# EAGLE design 612_jetracer_328_020032 (EAGLE 9.6.2)
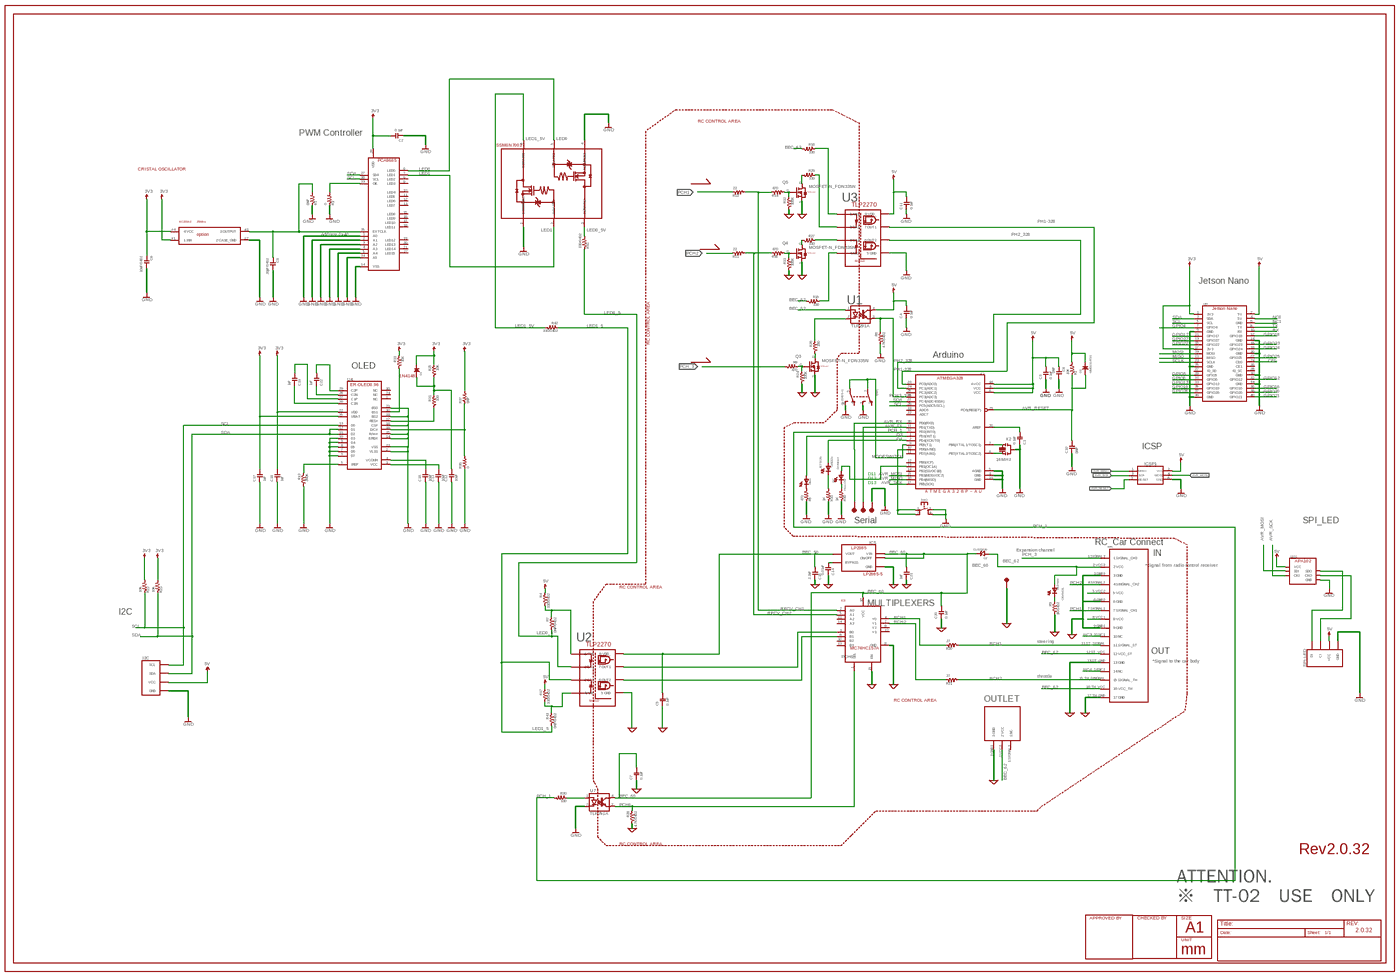
[diagram p0: schematic, sheet 1, overview]
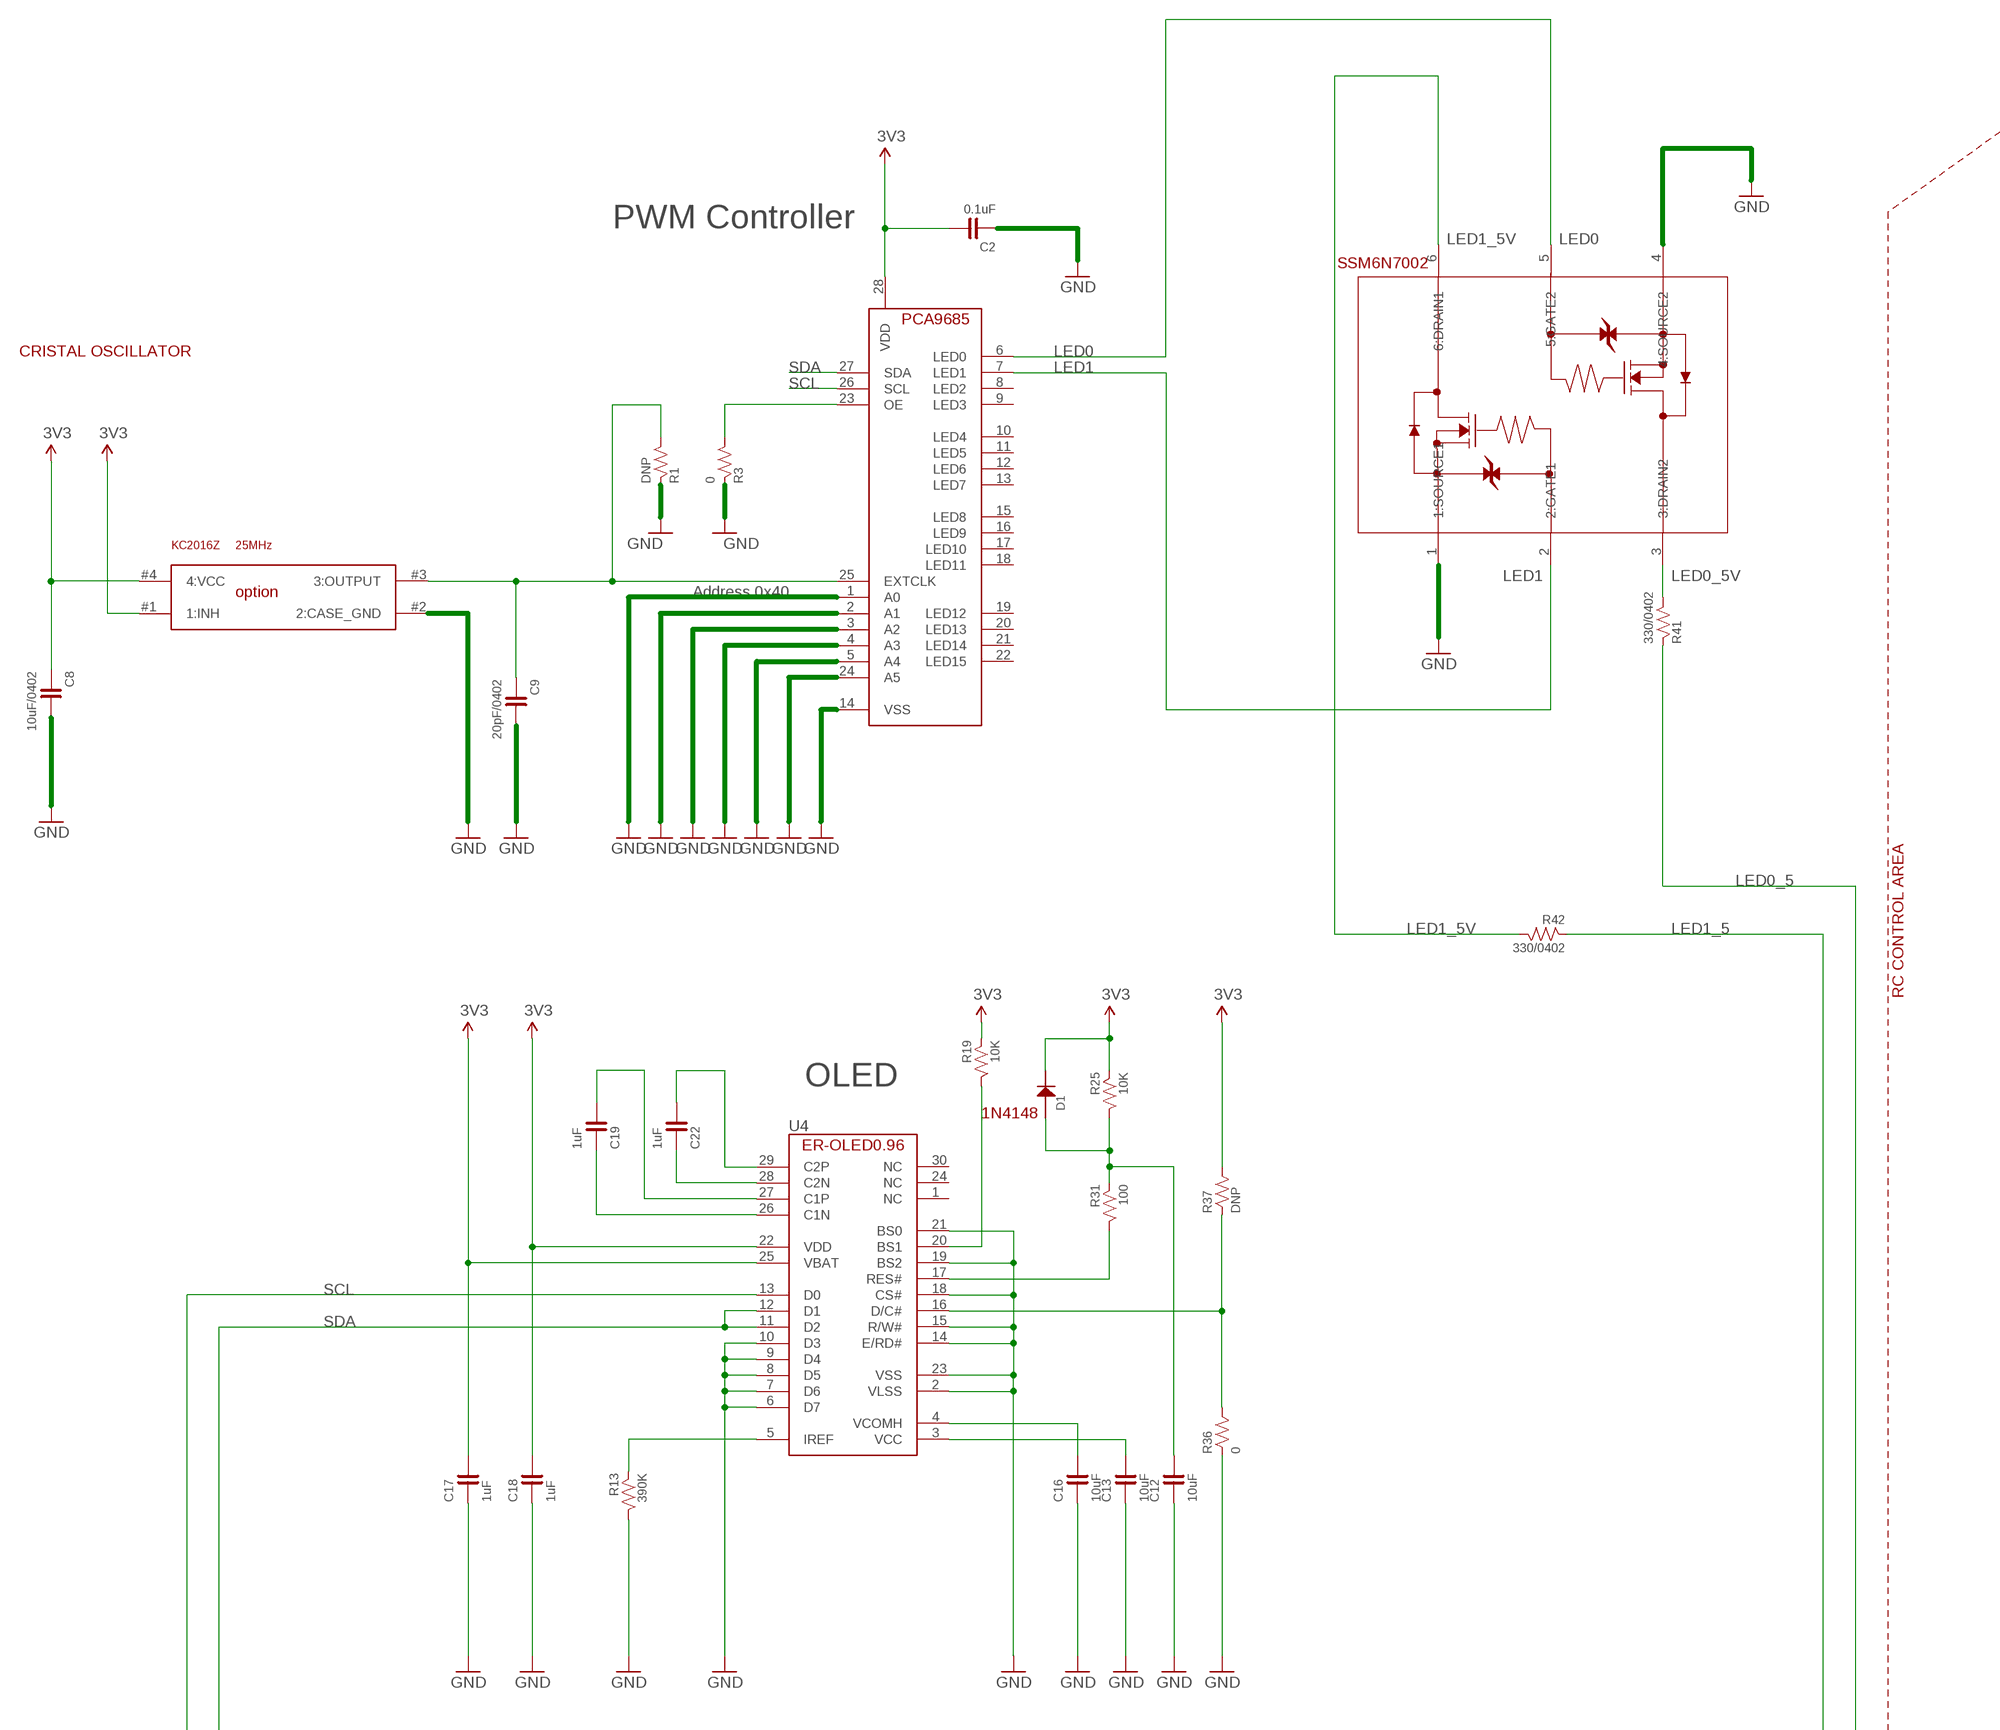
[diagram p1: schematic, sheet 1, part 1 of 4]
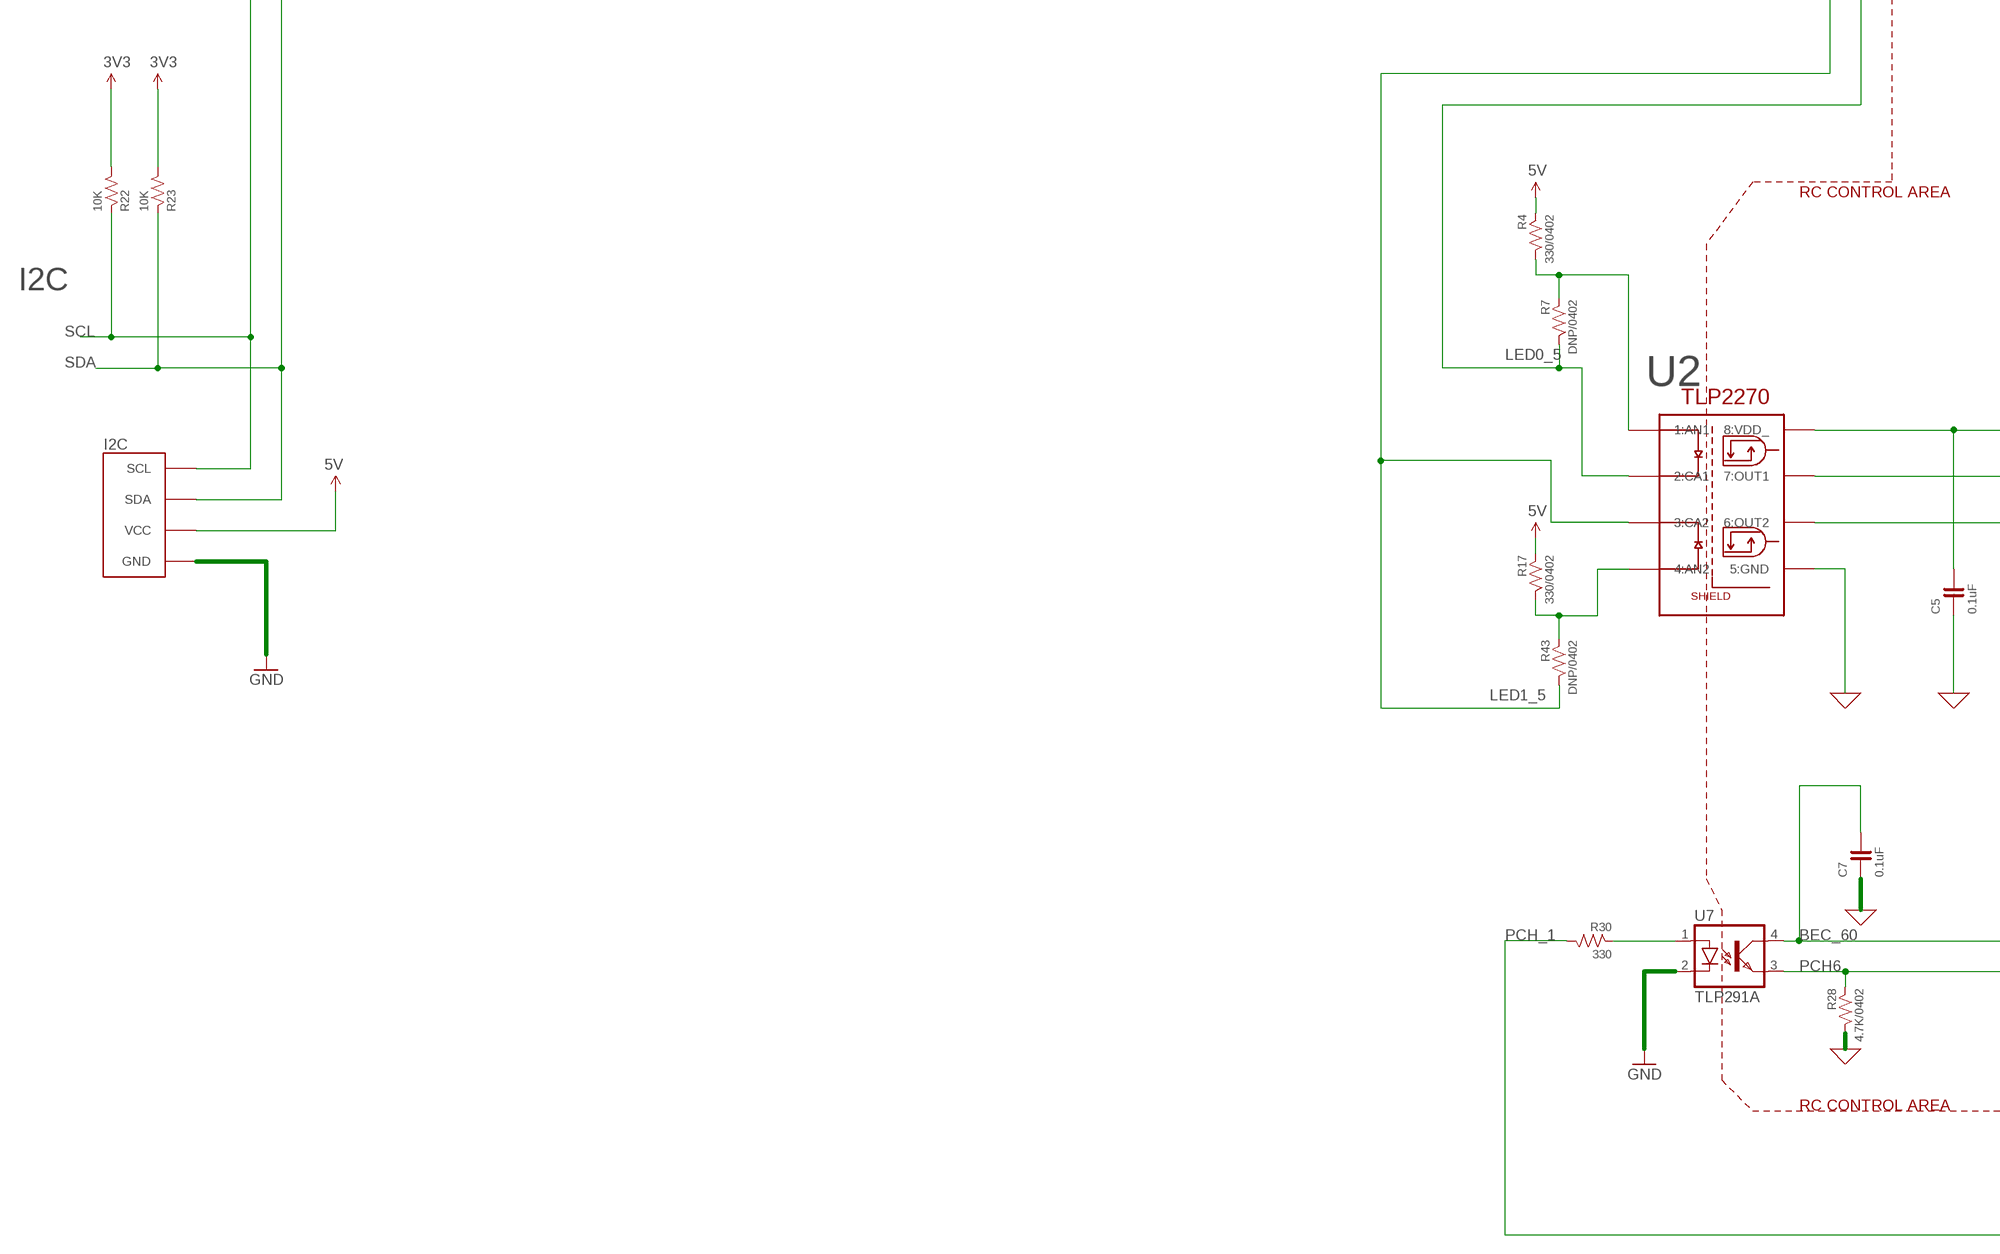
[diagram p2: schematic, sheet 1, part 2 of 4]
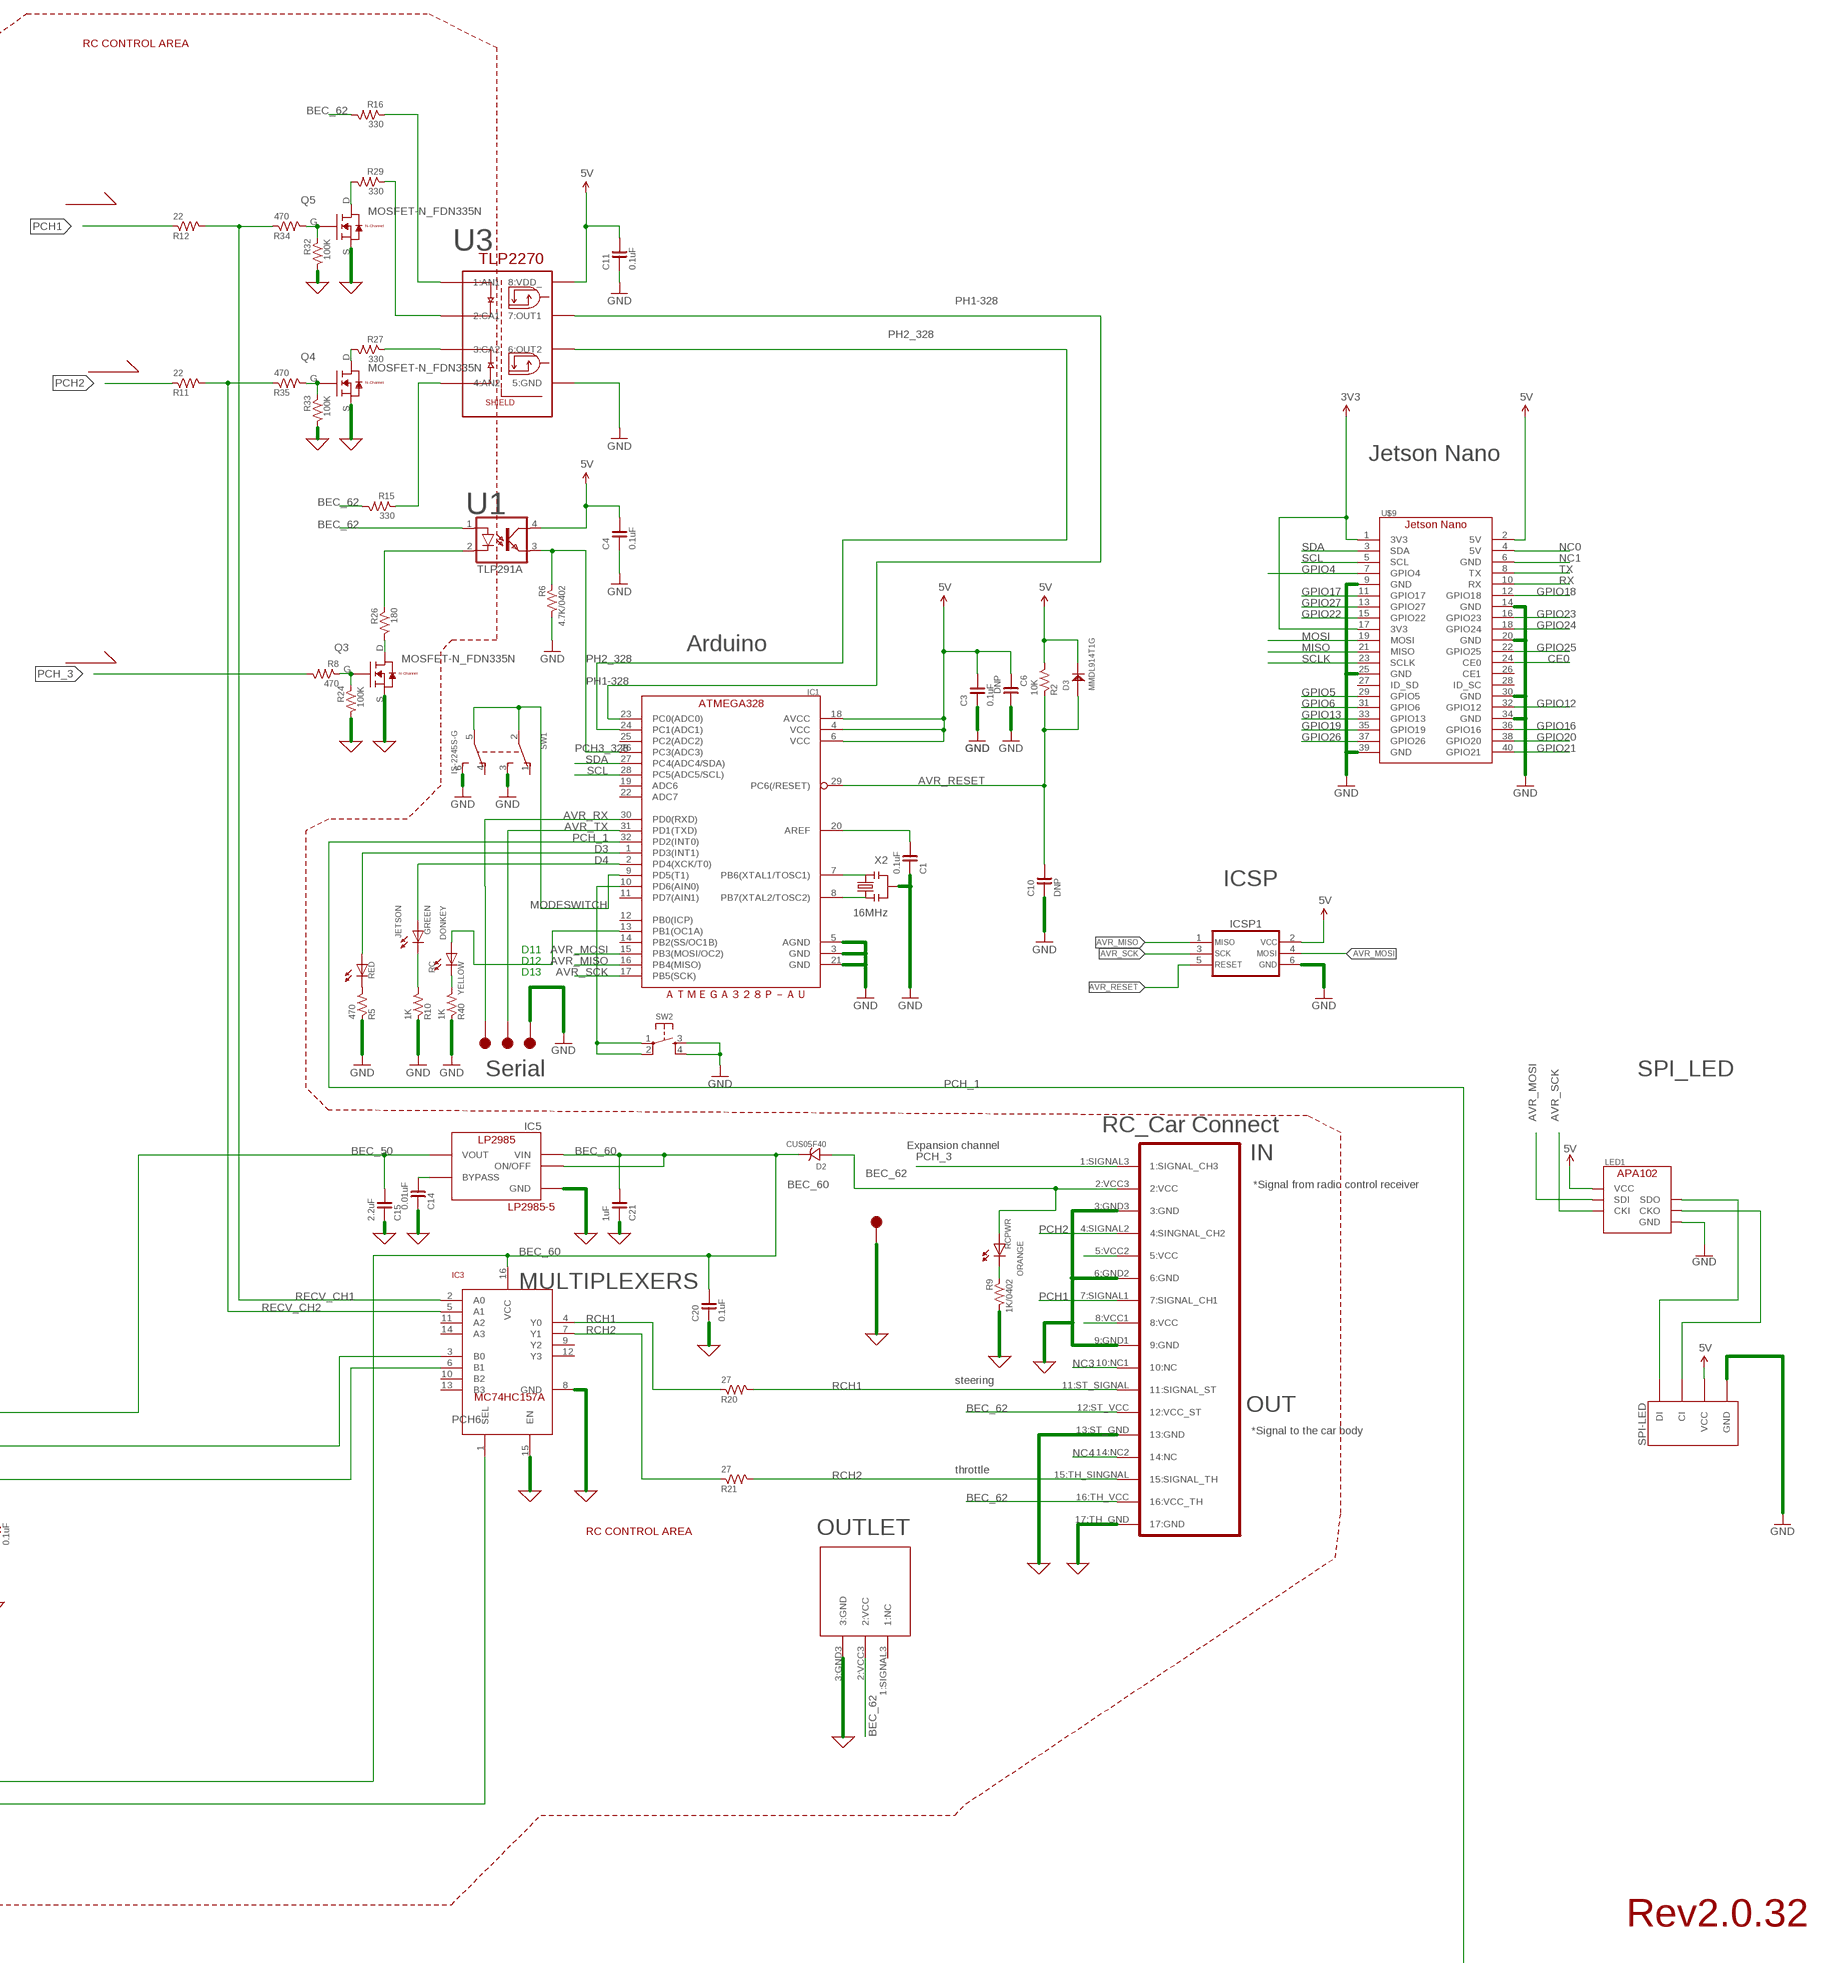
[diagram p3: schematic, sheet 1, part 3 of 4]
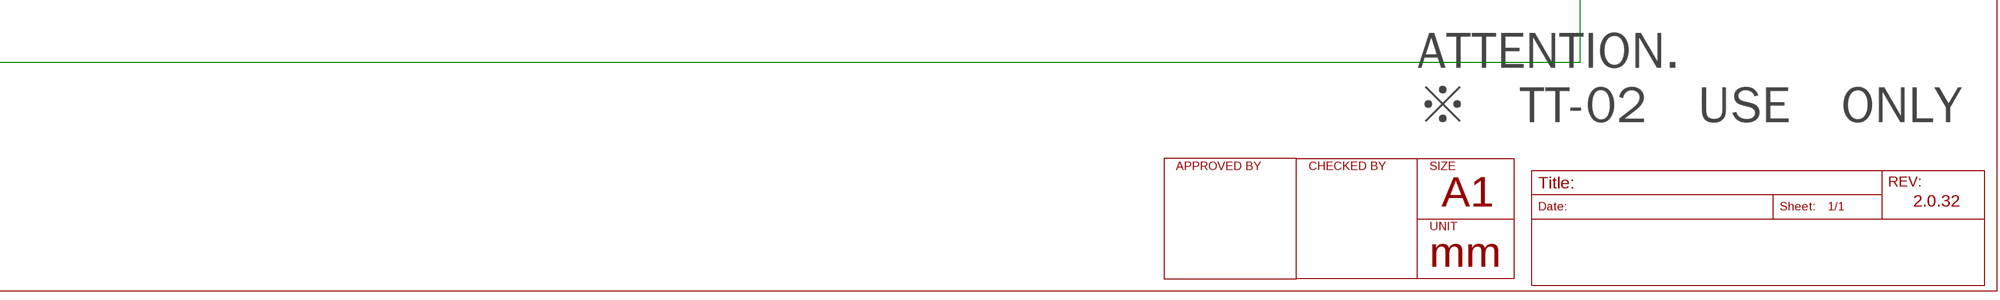
[diagram p4: schematic, sheet 1, part 4 of 4]

## Parts
BEC62TP1  TP-15  [TP-15]
C1  0.1uF  CAPACITOR-0603  [0603]
C2  0.1uF  CAPACITOR-0603  [0603]
C3  0.1uF  CAPACITOR-0402  [0402]
C4  0.1uF  CAPACITOR-0603  [0603]
C5  0.1uF  CAPACITOR-0402  [0402]
C6  DNP  CAPACITOR-0603  [0603]
C7  0.1uF  CAPACITOR-0402  [0402]
C8  10uF/0402  CAPACITOR-0402  [0402]
C9  20pF/0402  CAPACITOR-0402  [0402]
C10  DNP  CAPACITOR-0402  [0402]
C11  0.1uF  CAPACITOR-0603  [0603]
C12  10uF  CAPACITOR-0603  [0603]
C13  10uF  CAPACITOR-0603  [0603]
C14  0.01uF  CAPACITOR-0603  [0603]
C15  2.2uF  CAPACITOR-0603  [0603]
C16  10uF  CAPACITOR-0603  [0603]
C17  1uF  CAPACITOR-0603  [0603]
C18  1uF  CAPACITOR-0603  [0603]
C19  1uF  CAPACITOR-0603  [0603]
C20  0.1uF  CAPACITOR-0402  [0402]
C21  1uF  CAPACITOR-0603  [0603]
C22  1uF  CAPACITOR-0603  [0603]
D1  1N4148  [1N4148W]
D2  CUS05F40  [CUS05F40]
D3  MMDL914T1G  DIODE-SOD-323  [SOD-323]
DONKEY  YELLOW  LED-0603  [0603]
I2C  FABO-I2C  [I2C-SM04B-PASS-1-FL]
IC1  ATMEGA328P-AU  [TQFP-32]
IC3  MULTIPLEXERSMC74HC157A  [TSSOP-16]
IC4  PCA9685_BOTTOM  [PCA9685_BOTTOM]
IC5  LP2985-33DBV  [SOT-23-5]
ICSP1  ICSP_AVR-TC_NOHOLE  [TC2030]
JETSON  GREEN  LED-0603  [0603]
LED1  APA102_IPIXEL  [APA102_2020]
Q3  MOSFET-N_FDN335N  [SUPERSOT-3]
Q4  MOSFET-N_FDN335N  [SUPERSOT-3]
Q5  MOSFET-N_FDN335N  [SUPERSOT-3]
R1  DNP  RESISTOR-0603  [0603]
R2  10K  RESISTOR-0603  [0603]
R3  0  RESISTOR-0603  [0603]
R4  330/0402  RESISTOR-0402  [0402]
R5  470  RESISTOR-0603  [0603]
R6  4.7K/0402  RESISTOR-0402  [0402]
R7  DNP/0402  RESISTOR-0402  [0402]
R8  470  RESISTOR-0603  [0603]
R9  1K/0402  RESISTOR-0402  [0402]
R10  1K  RESISTOR-0603  [0603]
R11  22  RESISTOR-0603  [0603]
R12  22  RESISTOR-0603  [0603]
R13  390K  RESISTOR-0603  [0603]
R15  330  RESISTOR-0603  [0603]
R16  330  RESISTOR-0603  [0603]
R17  330/0402  RESISTOR-0402  [0402]
R19  10K  RESISTOR-0603  [0603]
R20  27  RESISTOR-0603  [0603]
R21  27  RESISTOR-0603  [0603]
R22  10K  RESISTOR-0603  [0603]
R23  10K  RESISTOR-0603  [0603]
R24  100K  RESISTOR-0603  [0603]
R25  10K  RESISTOR-0603  [0603]
R26  180  RESISTOR-0603  [0603]
R27  330  RESISTOR-0603  [0603]
R28  4.7K/0402  RESISTOR-0402  [0402]
R29  330  RESISTOR-0603  [0603]
R30  330  RESISTOR-0603  [0603]
R31  100  RESISTOR-0603  [0603]
R32  100K  RESISTOR-0603  [0603]
R33  100K  RESISTOR-0603  [0603]
R34  470  RESISTOR-0603  [0603]
R35  470  RESISTOR-0603  [0603]
R36  0  RESISTOR-0805  [0805]
R37  DNP  RESISTOR-0805  [0805]
R40  1K  RESISTOR-0603  [0603]
R41  330/0402  RESISTOR-0402  [0402]
R42  330/0402  RESISTOR-0402  [0402]
R43  DNP/0402  RESISTOR-0402  [0402]
RC  RED  LED-0603  [0603]
RCPWR  ORANGE  LED-0603  [0603]
SPI-LED  FABO-SPI-LED  [SPI-SM04B-PASS-1-FL]
SW1  IS-2245S-G  [IS-2245S-G]
SW2  TACT-SWITCH-SMD_KMR2  [KMR2]
TP1  TP-15  [TP-15]
TP2  TP-15  [TP-15]
TP3  TP-15  [TP-15]
U1  TLP291A  [11-3C1]
U2  TLP2270  [TLP2270]
U3  TLP2270  [TLP2270]
U4  ER-OLED0.96-1ER-CON30HT-1  [ER-CON30HT-1]
U7  TLP291A  [11-3C1]
U$1  RC_17PIN_OUTIN  [PNHEADER_2.54_SMT_17PIN_RC_TT01_02]
U$3  RC_3PIN_POWEROUT  [PNHEADER_2.54_SMT_3PIN_RC_TT01_02]
U$9  JETSON_NANOJETSON_NANO_OVERALL  [JETSON_NANO_DEMENTION]
U$10  SSM6N7002KFU  [US6]
U$11  KC2016Z  [KC2016Z]
X2  16MHz  RESONATOR  [CSTNE_V_C]

## Nets
0: BEC62TP1.1 C5.P$1 C7.P$1 C14.1 C15.1 C20.P$1 C21.1 IC3.8(GND) IC3.15(EN) IC5.2(GND) Q3.S Q4.S Q5.S R9.2 R24.2 R28.2 R32.2 R33.2 U2.5(5:GND) U$1.3:GND3(3:GND) U$1.6:GND2(6:GND) U$1.9:GND1(9:GND) U$1.13:ST_GND(13:GND) U$1.17:TH_GND(17:GND) U$3.3:GND3(3:GND) ; supply symbol labelled GND
3V3: C2.2 C8.P$1 C17.2 C18.2 D1.CATHODE IC4.28(VDD) R19.1 R22.2 R23.2 R25.1 R37.2 U4.22(VDD) U4.25(VBAT) U$9.1(3V3) U$9.17(3V3) U$11.#1(1:INH) U$11.#4(4:VCC)
5V: C3.P$2 C4.2 C6.1 C11.2 D3.K(CATHODE) I2C.5V(VCC) IC1.4(VCC) IC1.6(VCC) IC1.18(AVCC) ICSP1.2 LED1.VCC R2.2 R4.1 R17.1 SPI-LED.5V(VCC) U1.4(COL) U3.8(8:VDD_) U$9.2(5V)
AVR_MISO: IC1.16(PB4(MISO)) ICSP1.1
AVR_MOSI: IC1.15(PB3(MOSI/OC2)) ICSP1.4 LED1.SDI
AVR_RESET: C10.P$2 D3.A(ANODE) IC1.29(PC6(/RESET)) ICSP1.5 R2.1
AVR_RX: IC1.30(PD0(RXD)) TP1.1
AVR_SCK: IC1.17(PB5(SCK)) ICSP1.3 LED1.CKI
AVR_TX: IC1.31(PD1(TXD)) TP2.1
BEC_50: C5.P$2 C15.2 IC5.5(VOUT) U2.8(8:VDD_)
BEC_60: C7.P$2 C20.P$2 C21.2 D2.C(CATHODE) IC3.16(VCC) IC5.1(VIN) IC5.3(ON/OFF) U7.4(COL)
BEC_62: D2.A(ANODE) R15.2 R16.2 RCPWR.ANODE U1.1(A) U$1.2:VCC3(2:VCC) U$1.5:VCC2(5:VCC) U$1.8:VCC1(8:VCC) U$1.12:ST_VCC(12:VCC_ST) U$1.16:TH_VCC(16:VCC_TH) U$3.2:VCC3(2:VCC)
CE0: U$9.24(CE0)
D3: IC1.1(PD3(INT1)) RC.ANODE
D4: IC1.2(PD4(XCK/T0)) JETSON.ANODE
GND: C1.1 C2.1 C3.P$1 C4.1 C6.2 C8.P$2 C9.P$2 C10.P$1 C11.1 C12.1 C13.1 C16.1 C17.1 C18.1 I2C.GND IC1.3(GND) IC1.5(AGND) IC1.21(GND) IC4.1(A0) IC4.2(A1) IC4.3(A2) IC4.4(A3) IC4.5(A4) IC4.14(VSS) IC4.24(A5) ICSP1.6 LED1.GND R1.1 R3.1 R5.1 R6.2 R10.1 R13.2 R36.1 R40.1 SPI-LED.GND SW1.3 SW1.6 SW2.3 SW2.4 TP3.1 U3.5(5:GND) U4.2(VLSS) U4.6(D7) U4.7(D6) U4.8(D5) U4.9(D4) U4.10(D3) U4.14(E/RD#) U4.15(R/W#) U4.18(CS#) U4.19(BS2) U4.21(BS0) U4.23(VSS) U7.2(C) U$9.9(GND) U$9.14(GND) U$9.20(GND) U$9.25(GND) U$9.30(GND) U$9.34(GND) U$9.39(GND) U$10.1(1:SOURCE1) U$10.4(4:SOURCE2) U$11.#2(2:CASE_GND) X2.2
GPIO4: U$9.7(GPIO4)
GPIO5: U$9.29(GPIO5)
GPIO6: U$9.31(GPIO6)
GPIO12: U$9.32(GPIO12)
GPIO13: U$9.33(GPIO13)
GPIO16: U$9.36(GPIO16)
GPIO17: U$9.11(GPIO17)
GPIO18: U$9.12(GPIO18)
GPIO19: U$9.35(GPIO19)
GPIO20: U$9.38(GPIO20)
GPIO21: U$9.40(GPIO21)
GPIO22: U$9.15(GPIO22)
GPIO23: U$9.16(GPIO23)
GPIO24: U$9.18(GPIO24)
GPIO25: U$9.22(GPIO25)
GPIO26: U$9.37(GPIO26)
GPIO27: U$9.13(GPIO27)
LED0: IC4.6(LED0) U$10.5(5:GATE2)
LED0_5: R7.2 R41.1 U2.2(2:CA1)
LED0_5V: R41.2 U$10.3(3:DRAIN2)
LED1: IC4.7(LED1) U$10.2(2:GATE1)
LED1_5: R42.1 R43.2 U2.3(3:CA2)
LED1_5V: R42.2 U$10.6(6:DRAIN1)
MISO: U$9.21(MISO)
MODESWITCH: IC1.9(PD5(T1)) SW1.2 SW1.5
MOSI: U$9.19(MOSI)
N$2: R4.2 R7.1 U2.1(1:AN1)
N$3: C22.2 U4.29(C2P)
N$4: C1.2 IC1.20(AREF)
N$5: IC1.8(PB7(XTAL2/TOSC2)) X2.3
N$6: R26.1 U1.2(C)
N$7: IC4.23(OE) R3.2
N$8: DONKEY.ANODE IC1.13(PB1(OC1A))
N$9: R15.1 U3.4(4:AN2)
N$10: IC3.3(B0) U2.7(7:OUT1)
N$11: IC3.6(B1) U2.6(6:OUT2)
N$12: R16.1 U3.1(1:AN1)
N$13: R17.2 R43.1 U2.4(4:AN2)
N$14: R13.1 U4.5(IREF)
N$15: IC1.7(PB6(XTAL1/TOSC1)) X2.1
N$16: C19.2 U4.27(C1P)
N$17: C13.2 U4.3(VCC)
N$18: R31.2 U4.17(RES#)
N$19: R5.2 RC.CATHODE
N$20: JETSON.CATHODE R10.2
N$21: C19.1 U4.26(C1N)
N$22: C22.1 U4.28(C2N)
N$23: Q3.G R8.1 R24.1
N$24: R9.1 RCPWR.CATHODE
N$25: C16.2 U4.4(VCOMH)
N$26: Q3.D R26.2
N$27: Q4.D R27.2
N$28: R27.1 U3.3(3:CA2)
N$29: Q5.D R29.2
N$30: R29.1 U3.2(2:CA1)
N$31: C14.2 IC5.4(BYPASS)
N$32: C12.2 D1.ANODE R25.2 R31.1
N$33: Q5.G R32.1 R34.2
N$34: LED1.SDO SPI-LED.DI
N$35: R21.2 U$1.15:TH_SINGNAL(15:SIGNAL_TH)
N$36: R20.2 U$1.11:ST_SIGNAL(11:SIGNAL_ST)
N$37: R36.2 R37.1 U4.16(D/C#)
N$38: Q4.G R33.1 R35.2
N$39: LED1.CKO SPI-LED.CI
N$41: C9.P$1 IC4.25(EXTCLK) R1.2 U$11.#3(3:OUTPUT)
N$43: R30.1 U7.1(A)
N$44: DONKEY.CATHODE R40.2
N$50: R19.2 U4.20(BS1)
NC0: U$9.4(5V)
NC1: U$9.6(GND)
NC3: U$1.10:NC1(10:NC)
NC4: U$1.14:NC2(14:NC)
PCH1: R12.1 U$1.7:SIGNAL1(7:SIGNAL_CH1)
PCH2: R11.1 U$1.4:SIGNAL2(4:SINGNAL_CH2)
PCH3_328: IC1.26(PC3(ADC3)) R6.1 U1.3(EMI)
PCH6: IC3.1(SEL) R28.1 U7.3(EMI)
PCH_1: IC1.32(PD2(INT0)) R30.2
PCH_3: R8.2 U$1.1:SIGNAL3(1:SIGNAL_CH3)
PH1-328: IC1.23(PC0(ADC0)) U3.7(7:OUT1)
PH2_328: IC1.24(PC1(ADC1)) U3.6(6:OUT2)
RCH1: IC3.4(Y0) R20.1
RCH2: IC3.7(Y1) R21.1
RECV_CH1: IC3.2(A0) R12.2 R34.1
RECV_CH2: IC3.5(A1) R11.2 R35.1
RX: U$9.10(RX)
SCL: I2C.SCL IC1.28(PC5(ADC5/SCL)) IC4.26(SCL) R22.1 U4.13(D0) U$9.5(SCL)
SCLK: U$9.23(SCLK)
SDA: I2C.SDA IC1.27(PC4(ADC4/SDA)) IC4.27(SDA) R23.1 U4.11(D2) U4.12(D1) U$9.3(SDA)
SW: IC1.10(PD6(AIN0)) SW2.1 SW2.2
TX: U$9.8(TX)
Unconnected: IC1.11(PD7(AIN1)) IC1.12(PB0(ICP)) IC1.14(PB2(SS/OC1B)) IC1.19(ADC6) IC1.22(ADC7) IC1.25(PC2(ADC2)) IC3.9(Y2) IC3.10(B2) IC3.11(A2) IC3.12(Y3) IC3.13(B3) IC3.14(A3) IC4.8(LED2) IC4.9(LED3) IC4.10(LED4) IC4.11(LED5) IC4.12(LED6) IC4.13(LED7) IC4.15(LED8) IC4.16(LED9) IC4.17(LED10) IC4.18(LED11) IC4.19(LED12) IC4.20(LED13) IC4.21(LED14) IC4.22(LED15) SW1.1 SW1.4 U4.1(NC) U4.24(NC) U4.30(NC) U$3.1:SIGNAL3(1:NC) U$9.26(CE1) U$9.27(ID_SD) U$9.28(ID_SC)

## Notes on the sheet
- RC CONTROL AREA
- PWM Controller
- CRISTAL OSCILLATOR
- option | Address 0x40
- Jetson Nano
- RC CONTROL AREA
- Arduino
- OLED
- 1N4148
- ICSP
- D11
- D12
- D13
- ＡＴＭＥＧＡ３２８Ｐ－ＡＵ
- Serial | SPI_LED
- RC_Car Connect
- Expansion channel
- IN
- *Signal from radio control receiver
- LP2985-5
- RC CONTROL AREA
- MULTIPLEXERS
- I2C
- steering
- MC74HC157A
- OUT
- *Signal to the car body
- throttle
- RC CONTROL AREA | OUTLET
- RC CONTROL AREA
- Rev2.0.32
- ATTENTION.
  ※　TT-02　USE　ONLY
- 2.0.32

## Library data of the parts
BEC62TP1 TP1-TP3 = FaBo-Supply:TP
C1-C22 = FaBo-Capacitor:CAPACITOR: CAPACITOR
D1 = FaBo-Diode:1N4148
D2 = FaBo-Diode:CUS05F40
D3 = FaBo-Diode:DIODE
DONKEY JETSON RC RCPWR = FaBo-LED:LED
I2C = FaBo-Connetor:FABO-I2C
IC1 = component:ATMEGA328
IC3 = FaBo-Multiplexers:MULTIPLEXERS
IC4 = FaBo-Motor:PCA9685
IC5 = FaBo-Supply:LP2985: LP2985
ICSP1 = component:ICSP_AVR
LED1 = FaBo-LED:APA102
Q3-Q5 = FaBo-Mosfet:MOSFET-N
R1-R13 R15-R17 R19-R36 R40-R43 = FaBo-Resistors:RESISTOR: RESISTOR
R37 = FaBo-Resistors:RESISTOR: RESISTOR; SPICEPREFIX: R
SPI-LED = FaBo-Connetor:FABO-SPI-LED
SW1 = FaBo-Switch:IS-2245S-G
SW2 = FaBo-Switch:TACT-SWITCH: Part No Maker Datasheet Distributor 1273HA-160G-G SWITRONIC Catalog <http://www.switronic.com/uploads/images/A10.gif> Akizuki <http://akizukidenshi.com/catalog/g/gP-02561/> DTS-6-V Cosland DTS 6 Series <http://www.cosland.com/newproduct/DTS%20SERIES.pdf> Akizuki <http://akizukidenshi.com/catalog/g/gP-03647/> KMR2 C&K KMR2 SERIES <https://www.ckswitches.com/products/switches/product-details/Tactile/KMR2/> Octoparts Result <https://octopart.com/search?q=KMR2&start=0> TSHA-T-XB2-19E TOP UP INDUSTORY TSHA-T <http://www.top-up.com.tw/front/bin/ptdetail.phtml?Part=TSHA-T> Akizuki <http://akizukidenshi.com/catalog/g/gP-09361/>
U1 U7 = FaBo_Photocoupler:TLP291A
U2 U3 = FaBo-Photocoupler:TLP2270
U4 = FaBo-Display:ER-OLED0.96-1
U$1 = FaBo-PIN:RC_17PIN_OUTIN
U$3 = FaBo-PIN:RC_3PIN_POWEROUT
U$9 = FaBo-Boards:JETSON_NANO
U$10 = FaBo-Mosfet:SSM6N7002KFU
U$11 = FaBo-Crystal:KC2016Z
X2 = component:RESONATOR

## Board
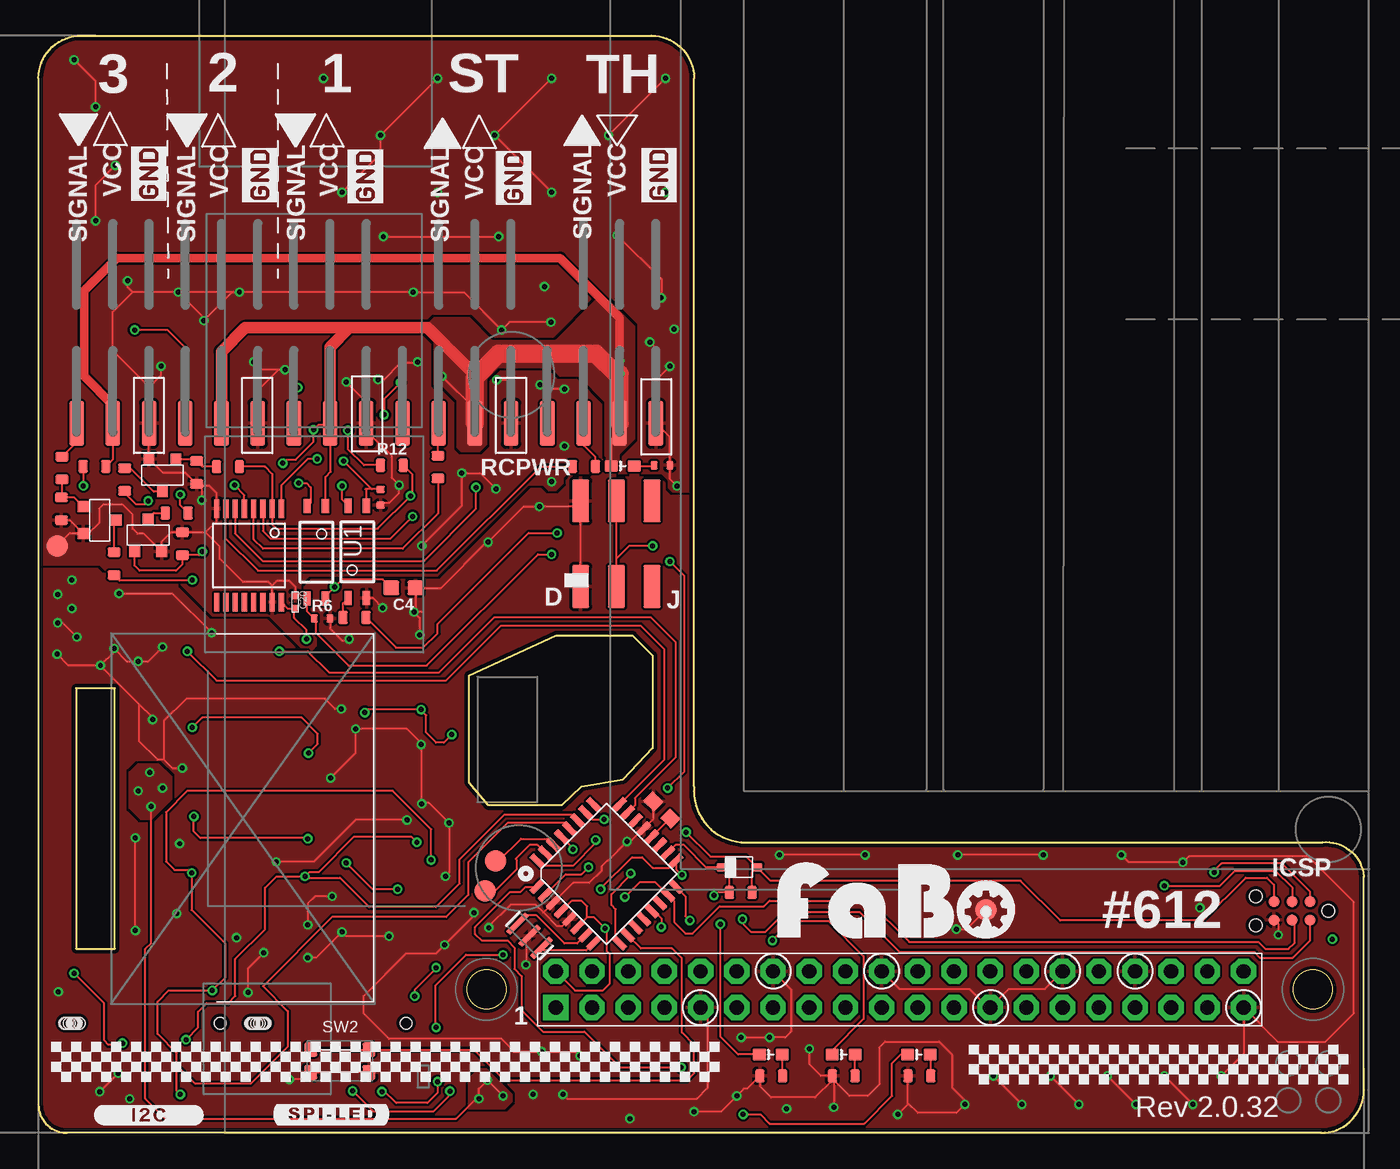
[diagram p5: board, top side]
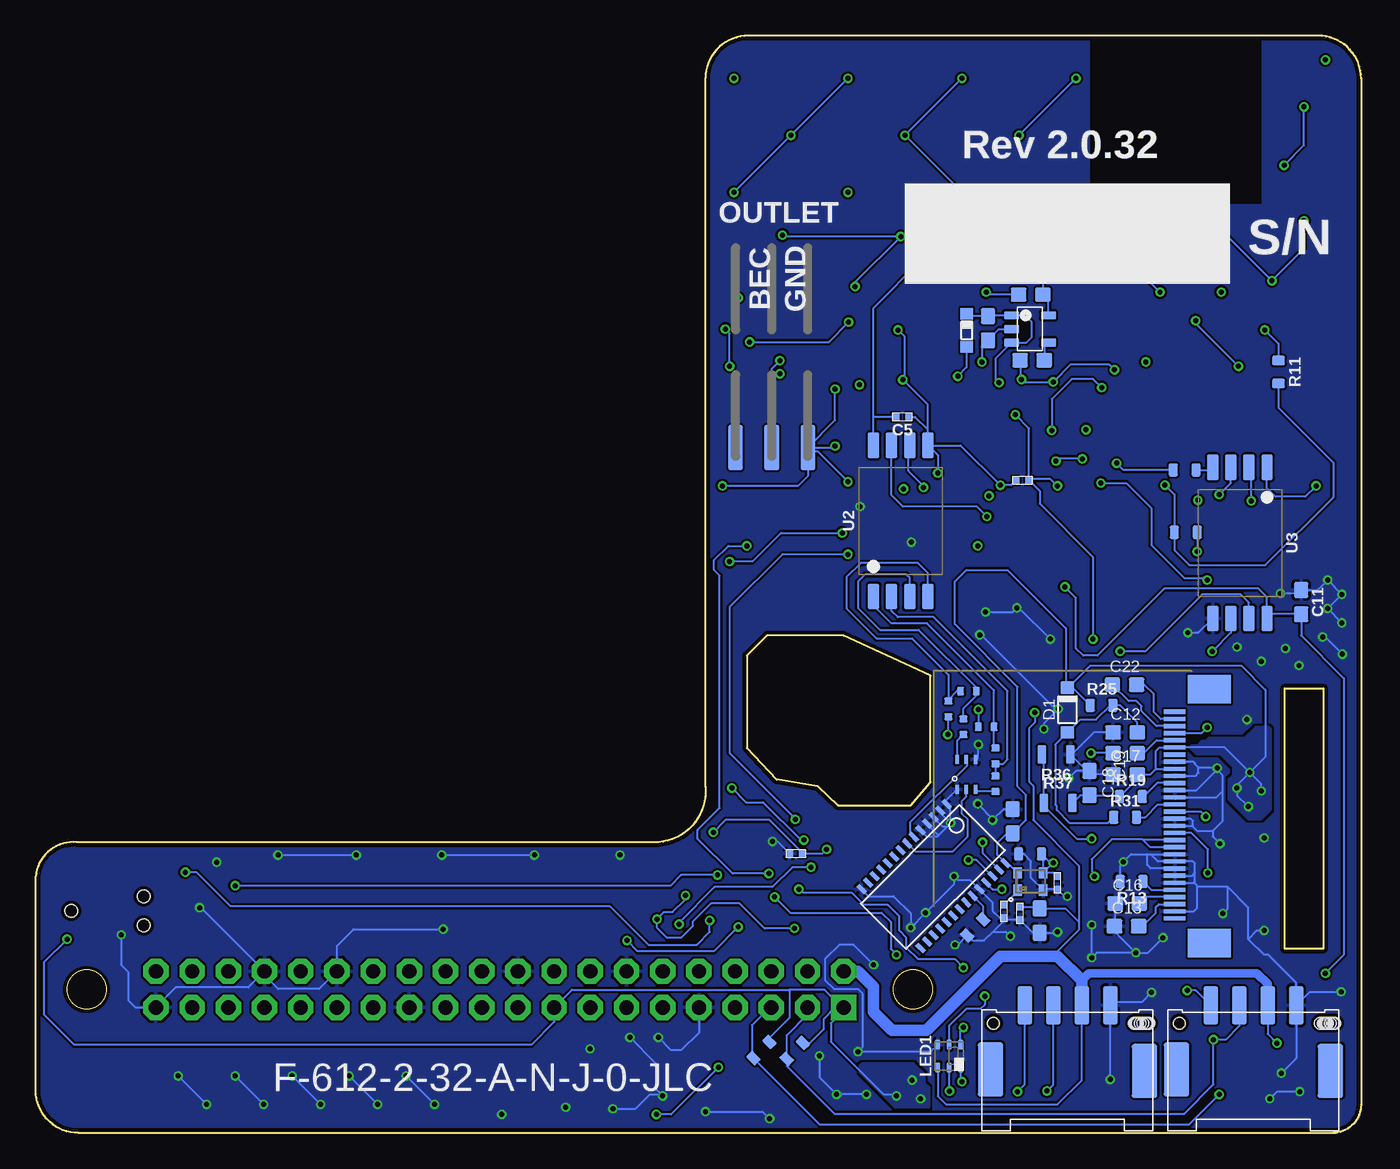
[diagram p6: board, bottom side, seen from below]

Size 93 x 77 mm. Coordinates in mm from the lower left corner, seen from the top.
Outline: 2,0 90,0 arc90 93,3 93,18 arc90 90.1,20.4 49.3,20.4 arc-90 46,24.3 46,74 arc90 43,77 3,77 arc90 0,74 0,2 arc90 2,0
Outline: 2,0 1.75,0
Outline: 2.64,31.2 2.64,12.92 5.35,12.92 5.35,31.2 2.64,31.2
Outline: 30.2,24.6 30.2,32.1 36.3,34.9 41.7,34.9 43.1,33.5 43.1,27 41,24.8 38.1,24.3 36.7,23 31.6,23 30.2,24.6
Copper layers (1*16): Top 0.035mm / dielectric 1.6mm / Bottom 0.035mm
Design rules "PCBway": minimum track width 6mil, minimum drill 12mil, track to track 6mil, track to pad 6mil, pad to pad 6mil, via to via 6mil, smd to smd 6mil, copper to edge 10mil, drill to drill 10mil, minimum pad ring 10mil, minimum via ring 6mil, stop-mask expansion 2mil, vias tented up to drill 100mil, thermal gap 8mil
bRestrict: area 7,65.2 to 19,78.8

### Footprints (pad centres in the part's own frame; a part is rotated, then mirrored left to right if it is on the bottom)
TP-15 = smd 1.5 x 1.5: 1 0,0
0603 = smd 1.1 x 1: 1 -0.85,0; 2 0.85,0
0402 = smd 0.5 x 0.5: P$1 -0.46,0; P$2 0.46,0
1N4148W = smd 0.9 x 0.95: ANODE 0,0; CATHODE 3.15,0
CUS05F40 = smd 0.8 x 0.9: A -1.15,0; C 1.15,0
SOD-323 = smd 0.8 x 0.6: A -1.2,0; K 1.2,0
0603' = smd 0.9 x 0.8: ANODE -0.8,0; CATHODE 0.8,0
I2C-SM04B-PASS-1-FL = smd 1 x 2.7: 5V -1,0; GND -3,0; SCL 3,0; SDA 1,0 | smd 1.8 x 3.8: P$5 -5.4,4.6; P$6 5.4,4.5 | hole 0.8: 5.2,1.25; -4.7,1.25; -5.7,1.25; -5.6,1.25; -5.4,1.25; -5.2,1.25; -5.1,1.25; -5,1.25; -4.9,1.25
TQFP-32 = smd 1.1 x 0.45: 1 -4.1,2.8; 2 -4.1,2; 3 -4.1,1.2; 4 -4.1,0.4; 5 -4.1,-0.4; 6 -4.1,-1.2; 7 -4.1,-2; 8 -4.1,-2.8; 17 4.1,-2.8; 18 4.1,-2; 19 4.1,-1.2; 20 4.1,-0.4; 21 4.1,0.4; 22 4.1,1.2; 23 4.1,2; 24 4.1,2.8 | smd 0.45 x 1.1: 9 -2.8,-4.1; 10 -2,-4.1; 11 -1.2,-4.1; 12 -0.4,-4.1; 13 0.4,-4.1; 14 1.2,-4.1; 15 2,-4.1; 16 2.8,-4.1; 25 2.8,4.1; 26 2,4.1; 27 1.2,4.1; 28 0.4,4.1; 29 -0.4,4.1; 30 -1.2,4.1; 31 -2,4.1; 32 -2.8,4.1
TSSOP-16 = smd 0.36 x 1.3: 1 -2.275,-3.28; 2 -1.625,-3.28; 3 -0.975,-3.28; 4 -0.325,-3.28; 5 0.325,-3.28; 6 0.975,-3.28; 7 1.625,-3.28; 8 2.275,-3.28; 9 2.275,3.28; 10 1.625,3.28; 11 0.975,3.28; 12 0.325,3.28; 13 -0.325,3.28; 14 -0.975,3.28; 15 -1.625,3.28; 16 -2.275,3.28
PCA9685_BOTTOM = smd 0.3 x 0.75 bottom: 1 4.3,-2.93; 2 3.65,-2.93; 3 3,-2.93; 4 2.35,-2.93; 5 1.7,-2.93; 6 1.05,-2.93; 7 0.4,-2.93; 8 -0.25,-2.93; 9 -0.9,-2.93; 10 -1.55,-2.93; 11 -2.2,-2.93; 12 -2.85,-2.93; 13 -3.5,-2.93; 14 -4.15,-2.93; 15 -4.15,2.92; 16 -3.5,2.92; 17 -2.85,2.92; 18 -2.2,2.92; 19 -1.55,2.92; 20 -0.9,2.92; 21 -0.25,2.92; 22 0.4,2.92; 23 1.05,2.92; 24 1.7,2.92; 25 2.35,2.92; 26 3,2.92; 27 3.65,2.92; 28 4.3,2.92
SOT-23-5 = smd 0.6 x 1.05: 1 -0.95,-1.3; 2 0,-1.3; 3 0.95,-1.3; 4 0.95,1.3; 5 -0.95,1.3
TC2030 = smd 0.787 x 0.787: 1 1.27,-0.635; 2 1.27,0.635; 3 2.54,-0.635; 4 2.54,0.635; 5 3.81,-0.635; 6 3.81,0.635 | hole 0.889: 0,0; 5.08,-1.016; 5.08,1.016
APA102_2020 = smd 0.7 x 0.35: CKI 0.8,0; CKO -0.8,0; GND 0.8,0.8; SDI 0.8,-0.8; SDO -0.8,-0.8; VCC -0.8,0.8
SUPERSOT-3 = smd 0.76 x 0.76: D 0,1.15; G -0.95,-1.15; S 0.95,-1.15
0603'' = smd 0.65 x 0.9: 1 -0.8,0; 2 0.8,0
0402' = smd 0.5 x 0.6: 1 -0.55,0; 2 0.55,0
0805 = smd 0.6 x 1.3: 1 -1,0; 2 1,0
SPI-SM04B-PASS-1-FL = smd 1 x 2.7: 5V -1,-0.1; CI 1,-0.1; DI 3,-0.1; GND -3,-0.1 | smd 1.8 x 3.8: P$5 -5.4,4.5; P$6 5.4,4.4 | hole 0.8: 5.2,1.15; -4.7,1.15; -5.7,1.15; -4.8,1.15; -4.9,1.15; -5.1,1.15; -5.3,1.15; -5.5,1.15; -5.6,1.15
IS-2245S-G = smd 1.2 x 3: 1 -2.5,3; 2 0,3; 3 2.5,3; 4 -2.5,-3; 5 0,-3; 6 2.5,-3
KMR2 = smd 0.9 x 1: 1 -2.05,0.8; 2 2.05,0.8; 3 2.05,-0.8; 4 -2.05,-0.8
11-3C1 = smd 1 x 0.5: 1 -3.24,0.635; 2 -3.24,-0.635; 3 3.24,-0.635; 4 3.24,0.635
TLP2270 = smd 0.8 x 1.8: 1 -1.905,-5.3; 2 -0.635,-5.3; 3 0.635,-5.3; 4 1.905,-5.3; 5 1.905,5.3; 6 0.635,5.3; 7 -0.635,5.3; 8 -1.905,5.3
ER-CON30HT-1 = smd 0.3 x 1.5 bottom: 1 7,-0.23; 2 6.5,-0.23; 3 6,-0.23; 4 5.5,-0.23; 5 5,-0.23; 6 4.5,-0.23; 7 4,-0.23; 8 3.5,-0.23; 9 3,-0.23; 10 2.5,-0.23; 11 2,-0.23; 12 1.5,-0.23; 13 1,-0.23; 14 0.5,-0.23; 15 0,-0.23; 16 -0.5,-0.23; 17 -1,-0.23; 18 -1.5,-0.23; 19 -2,-0.23; 20 -2.5,-0.23; 21 -3,-0.23; 22 -3.5,-0.23; 23 -4,-0.23; 24 -4.5,-0.23; 25 -5,-0.23; 26 -5.5,-0.23; 27 -6,-0.23; 28 -6.5,-0.23; 29 -7,-0.23; 30 -7.5,-0.23 | smd 2 x 3 bottom: 31 -9.07,-2.67; 32 8.74,-2.67
PNHEADER_2.54_SMT_17PIN_RC_TT01_02 = smd 1.02 x 3.17: 1:SIGNAL3 -20.32,0; 2:VCC3 -17.78,0; 3:GND3 -15.24,0; 4:SIGNAL2 -12.7,0; 5:VCC2 -10.16,0; 6:GND2 -7.62,0; 7:SIGNAL1 -5.08,0; 8:VCC1 -2.54,0; 9:GND1 0,0; 10:NC1 2.54,0; 11:ST_SIGNAL 5.08,0; 12:ST_VCC 7.62,0; 13:ST_GND 10.16,0; 14:NC2 12.7,0; 15:TH_SINGNAL 15.24,0; 16:TH_VCC 17.78,0; 17:TH_GND 20.32,0
PNHEADER_2.54_SMT_3PIN_RC_TT01_02 = smd 1.02 x 3.17: 1:SIGNAL3 -2.54,0; 2:VCC3 0,0; 3:GND3 2.54,0
JETSON_NANO_DEMENTION = drill 1 pad 1.778 square: 1 0,0 | drill 1 pad 1.778 octagon: 2 0,2.54; 3 2.54,0; 4 2.54,2.54; 5 5.08,0; 6 5.08,2.54; 7 7.62,0; 8 7.62,2.54; 9 10.16,0; 10 10.16,2.54; 11 12.7,0; 12 12.7,2.54; 13 15.24,0; 14 15.24,2.54; 15 17.78,0; 16 17.78,2.54; 17 20.32,0; 18 20.32,2.54; 19 22.86,0; 20 22.86,2.54; 21 25.4,0; 22 25.4,2.54; 23 27.94,0; 24 27.94,2.54; 25 30.48,0; 26 30.48,2.54; 27 33.02,0; 28 33.02,2.54; 29 35.56,0; 30 35.56,2.54; 31 38.1,0; 32 38.1,2.54; 33 40.64,0; 34 40.64,2.54; 35 43.18,0; 36 43.18,2.54; 37 45.72,0; 38 45.72,2.54; 39 48.26,0; 40 48.26,2.54
US6 = smd 0.3 x 0.635: 1 -0.65,-1.05; 2 0,-1.05; 3 0.65,-1.05; 4 0.65,1.05; 5 0,1.05; 6 -0.65,1.05
KC2016Z = smd 0.6 x 0.8: #1 -0.9,-0.6; #2 0.9,-0.6; #3 0.9,0.6; #4 -0.9,0.6
CSTNE_V_C = smd 0.4 x 1.9: 1 1.2,0; 2 0,0; 3 -1.2,0

### Placement (x,y rotation side)
BEC62TP1  1.3,41.2 0 top
C1  43.74,22.66 315 top
C2  24.45,21.86 270 bottom
C3  23.93,15.42 90 bottom
C4  25.6,38.25 180 top
C5  32.19,50.25 180 bottom
C6  22.55,14.9 270 bottom
C7  23.75,45.8 0 bottom
C8  25.05,15.55 270 bottom
C9  21.3,17.55 270 bottom
C10  39.65,19.6 0 bottom
C11  4.2,37.25 270 bottom
C12  16.55,28.1 0 bottom
C13  16.45,14.5 0 bottom
C14  23.07,54.22 0 bottom
C15  23.17,58.83 0 bottom
C16  16.4,16.1 0 bottom
C17  16.55,25.15 0 bottom
C18  19.05,24.55 270 bottom
C19  16.55,26.65 180 bottom
C20  18,37.25 270 top
C21  26.18,56.47 90 bottom
C22  16.6,31.45 0 bottom
D1  20.6,28.1 90 bottom
D2  27.68,56.32 90 bottom
D3  49.2,18.65 180 top
DONKEY  YELLOW  [0603']  56.5,5.5 0 top
I2C  7.55,8.95 180 bottom
IC1  39.86,18.18 45 top
IC3  14.77,40.52 180 top
IC4  30.05,17.96 135 top
IC5  23.23,56.42 270 bottom
ICSP1  90.5,15.59 180 top
JETSON  GREEN  [0603']  51.39,5.5 0 top
LED1  28.9,5.4 90 bottom
Q3  4.3,43 270 top
Q4  7.7,41.95 0 top
Q5  8.7,46.15 180 top
R1  DNP  [0603'']  23.23,19.57 0 bottom
R2  10K  [0603'']  49.27,16.87 180 top
R3  0  [0603'']  27.07,14.42 45 bottom
R4  330/0402  [0402']  26.3,28.5 0 bottom
R5  470  [0603'']  61.82,4 0 top
R6  4.7K/0402  [0402']  19.9,36.1 0 top
R7  DNP/0402  [0402']  25.65,26.45 270 bottom
R8  470  [0603'']  1.65,46.65 90 top
R9  1K/0402  [0402']  43.75,46.85 0 top
R10  1K  [0603'']  51.42,4 0 top
R11  22  [0603'']  5.8,53.4 270 bottom
R12  22  [0603'']  24.8,46.85 0 top
R13  390K  [0603'']  16.1,17.65 180 bottom
R15  330  [0603'']  12.38,46.52 180 bottom
R16  330  [0603'']  3.92,46.77 0 top
R17  330/0402  [0402']  28.95,29.75 90 bottom
R19  10K  [0603'']  16.15,23.6 0 bottom
R20  27  [0603'']  28.02,46.72 90 top
R21  27  [0603'']  38.27,46.77 0 top
R22  10K  [0603'']  42.08,5.82 45 bottom
R23  10K  [0603'']  39.73,5.75 45 bottom
R24  100K  [0603'']  1.6,43.8 270 top
R25  10K  [0603'']  18.2,30 0 bottom
R26  180  [0603'']  5.3,39.95 90 top
R27  330  [0603'']  9.7,43.5 180 top
R28  4.7K/0402  [0402']  24,44.6 270 top
R29  330  [0603'']  6.05,45.85 90 top
R30  330  [0603'']  22.18,36.17 0 top
R31  100  [0603'']  16.55,22.15 0 bottom
R32  100K  [0603'']  11.1,46.35 270 top
R33  100K  [0603'']  10.1,41.35 90 top
R34  470  [0603'']  13.3,46.75 180 top
R35  470  [0603'']  12.3,42.15 0 bottom
R36  21.4,26.55 180 bottom
R37  21.25,23.15 0 bottom
R40  1K  [0603'']  56.5,4 0 top
R41  330/0402  [0402']  25.65,24.5 270 bottom
R42  330/0402  [0402']  27.9,28.5 270 bottom
R43  DNP/0402  [0402']  27.55,31 0 bottom
RC  RED  [0603']  61.78,5.5 0 top
RCPWR  ORANGE  [0603']  41,46.8 0 top
SPI-LED  20.6,8.85 180 bottom
SW1  40.55,41.35 180 top
SW2  21.15,5.05 0 top
TP1  32.07,19.07 90 top
TP2  31.33,16.98 0 top
TP3  66.46,15.67 0 top
U1  19.5,40.75 270 top
U2  32.3,42.95 0 bottom
U3  8.5,41.4 180 bottom
U4  13.31,22.05 270 top
U7  22.38,40.77 90 top
U$1  23,49.8 0 top
U$2  [LOGO_FABO_L]  59.5,13.65 0 top
U$3  41.35,48.1 0 bottom
U$5  [LOGO_SILK_GND]  16.8,65.3 90 top
U$6  [LOGO_SILK_GND]  24.2,65.2 90 top
U$7  [LOGO_SILK_GND]  34.6,65.1 90 top
U$8  [LOGO_SILK_GND]  44.8,65.3 90 top
U$9  36.3,8.8 0 top
U$10  27.7,25.15 0 bottom
U$11  23.2,17.65 0 bottom
U$12  [LOGO_SILK_GND]  9,65.4 90 top
X2  34.46,13.84 135 top

### Tracks (layer width: path | path; a pad name or v marks a point on that pad's centre or on a via)
0  (via drill 0.35)
  Top 0.152: 11.7,42.15 R33.2 9.3,42.15 8.65,41.5 Q4.S 7.4,42.05 6.95,42.05 6.6,42.4 6.6,43.4 5.9,44.1 4.55,44.1 4.25,43.8 4.25,42.8 3.5,42.05 Q3.S 3.1,42.1 | 11.7,42.15 11.75,42.15 12.5,42.9 IC3.8 12.5,44.9 12,45.4 11.25,45.4 | 11.25,45.4 R32.2 10.3,46.35 8.7,46.35 Q5.S U$1.3:GND3 7.76,52.34 | 11.25,45.4 11.45,45.2 v11.45,44.4 | R24.2 2.2,43 3.1,42.1 | v21.6,52.7 23,51.3 U$1.9:GND1 23,49.3 24.8,47.5 24.8,45.95 v25.3,45.45 25.3,44.9 24.65,44.25 24.2,44.25 R28.2 | 16.45,37.29 IC3.15 16.4,38.4 | 16.4,38.4 16.75,38.75 17.6,38.75 18,38.35 C20.P$1 | v32.15,52.85 32.95,52.85 33.16,52.64 U$1.13:ST_GND | U$1.17:TH_GND 43.32,55.08 v42.9,55.5 | v35.95,56.9 33.05,56.9 v32.5,56.35 29.85,59 v26.3,59 v14.1,59 | 16.4,38.4 16.15,38.65 14.35,38.65 12.7,40.3 12.7,41.15 11.7,42.15 | U$1.17:TH_GND 44.3,48.82 R9.2 44.3,45.9 v44.8,45.4 | U$1.6:GND2 15.38,52.08 16.85,53.55 v17.3,53.55 15.65,53.55 v15.1,54.1 | 6.6,59 5.2,57.6 5.2,54.9 7.76,52.34 | v14.1,59 v9.8,59 | v9.8,59 6.6,59 | v26.6,54.1 26.51,54.01 25.37,54.01 24.24,52.88 v23.82,52.88 | BEC62TP1.1 2.2,42.1 3.1,42.1 | 6.6,59 6.25,59.35 v6.25,59.8 | v4,64 4,66.5 v5.4,67.9 | v4,72 4,73.8 v2.5,75.3 | v21.3,66 24,68.7 v24,70 v28,74 | v36,74 v32,70 v36,66 | v40,70 v44,74 | 7.76,52.34 8.6,53.18 v8.6,53.8 | v9.8,59 11.6,57.2 v11.6,57 13.6,59 v14.1,59 | v24.2,62.9 v32.3,62.9 | v40.6,63 43.7,59.9 v43.7,58.6 | U$1.17:TH_GND 43.32,52.82 v44.3,53.8 | v26.9,41.2 29.7,44 v29.7,46.3 31,46.3 v32.1,45.2 | v36.9,52.2 35.5,52.2 v35.2,52.5
  Bottom 0.152: v17.3,53.55 17.7,53.95 20.35,53.95 v21.6,52.7 23.65,52.7 v23.82,52.88 23.9,52.95 23.9,54.2 C14.1 | IC5.2 24.55,56.4 25.39,56.4 C21.1 26.6,55.62 v26.6,54.1 | C5.P$1 31.3,50.25 30.4,49.34 U2.5 | U2.5 30.4,51.09 32.05,52.75 | 32.05,52.75 v32.15,52.85 | C7.P$1 24.56,45.45 v25.3,45.45 28.1,48.25 U2.5 | v42.9,55.5 37.35,55.5 v35.95,56.9 | v32.5,56.35 32.05,55.9 32.05,52.75 | U$3.3:GND3 38.81,47.8 | 38.81,47.8 38.81,46.09 39.5,45.4 v44.8,45.4 | C15.1 26.12,58.83 v26.3,59 | v36,45.7 38.1,47.8 38.81,47.8 | U$3.3:GND3 36.9,50.01 v36.9,52.2 | v4,64 4,62.05 v6.25,59.8 9.35,62.9 18.5,62.9 21.3,65.7 v21.3,66 | v5.4,67.9 4,69.3 v4,72 | v24,70 v20,74 | v28,74 v32,70 v28,66 | v36,74 v40,70 v44,66 | v8.6,53.8 11.6,56.8 v11.6,57 | v14.1,59 15.6,60.5 21.8,60.5 v24.2,62.9 | v40.6,63 40.5,62.9 v32.3,62.9 35.5,59.7 v35.5,59.4 | v44.3,53.8 44.3,56.1 v44.6,56.4 | U2.5 29.7,47.55 v29.7,46.3 | U$3.3:GND3 37,48.1 v36.9,48.2
  pour Top (rank 5): -1.3,39.9 4.3,39.9 5.4,38.8 9.7,38.8 12.2,36.3 16.2,36.3 18.6,33.9 19.2,33.9 19.5,34.2 19.5,34.8 18.4,35.9 18.4,38.5 19,39.1 28,39.1 34.4,45.5 35.4,45.5 35.8,45.1 36.3,45.1 36.8,45.6 36.8,46 37.1,46.3 43.7,46.3 44.2,45.8 44.2,45.3 44.5,45 46.3,45 47.3,46 47.3,79.3 1.4,79.3 -1.4,76.5 -1.4,40
3V3  (via drill 0.35)
  Top 0.152: v90.8,13.6 90.58,13.6 | v32.6,2.6 v31.5,3.7 30.9,3.1 v30.9,2.4 30.7,2.4 29.3,1 8.9,1 7.5,2.4 7.5,12.9 7.9,13.3 v7.9,22.9
  Bottom 0.152: R25.1 20.25,31.25 D1.CATHODE | 14.4,25.55 14.8,25.15 C17.2 15.7,24.85 16.93,23.62 | 14.4,25.55 U4.22 | 16.93,23.62 R19.1 17.2,23.85 | IC4.28 24.95,18.95 | 24.95,18.95 25.5,19.5 25.5,20.35 24.84,21.02 C2.2 23.5,21.95 23.5,23.7 24.1,24.3 24.1,31.3 28.5,35.7 28.5,38.7 27.7,39.5 24.8,39.5 20.7,35.4 20.7,31.25 D1.CATHODE | R22.2 41.51,6.69 40.11,8.09 40.11,10.05 | U$9.17 55.37,10.05 40.11,10.05 | 14.4,25.55 14.4,26.8 14.15,27.05 U4.25 9.55,27.05 v7.8,25.3 | 24.95,18.95 24.8,18.95 U$11.#4 U$11.#1 24.1,16.96 C8.P$1 24.95,16.11 | U$9.17 56.62,7.78 58.2,6.2 90.3,6.2 92.4,8.3 92.4,12 v90.8,13.6 | R37.2 19.7,23.7 C18.2 17,23.7 16.93,23.62 | 57,8.8 U$9.17 | R23.2 38.68,6.32 37.7,7.3 37.7,8 36.9,8.8 36.4,8.8 | 36.4,8.8 U$9.1 36.3,8.6 37.2,7.7 37.2,6.4 33.5,2.7 32.7,2.7 v32.6,2.6 | v7,24 7,24.5 v7.8,25.3 | v7.8,25.3 8.7,24.4 v8.7,24.2 8.7,23.7 v7.9,22.9 | 36.4,8.8 37.65,10.05 40.11,10.05 | D1.CATHODE 20.55,31.25 19,32.8 8.4,32.8 6.7,31.1 6.7,26.4 v7.8,25.3
  pour Top (no thermals): 6.4,22.8 6.4,25.3 7,25.9 8.4,25.9 9.3,25 9.3,23.4 7.9,22 7.2,22
  pour Bottom (no thermals): 6.3,22.7 6.3,28.3 6.5,28.5 7.4,28.5 8.2,27.7 10.7,27.7 10.9,27.5 11.2,27.5 11.5,27.2 11.9,27.2 12,27.1 12,27 11.6,26.6 9.9,26.6 9,25.7 9,25.1 9.3,24.8 9.3,23.4 7.9,22 7,22
  pour Bottom (no thermals): 30.3,1.8 30.3,3.2 30.6,3.5 30.6,4.1 31.4,4.9 35,4.9 35.2,4.7 35.2,4.3 32.7,1.8
  pour Top (no thermals): 30.2,1.7 30.2,3.8 30.9,4.5 31.4,4.5 33.2,2.7 33.2,2.2 32.7,1.7
5V  (via drill 0.35)
  Top 0.152: v26.85,29.7 26.8,29.7 | 26.8,29.7 23.1,29.7 v22.9,29.5 | v29,27.95 28.45,27.4 27.9,27.4 27.2,28.1 27.2,29.3 26.8,29.7 | U1.4 20.14,37.69 v20.77,38.33 21.3,38.85 24.15,38.85 C4.2 | IC1.6 38.5,15.13 | 38.5,15.13 38.5,15.9 38.1,16.3 37.41,16.3 IC1.4 | U$9.2 37.64,10 39.6,10 40.1,10.5 40.1,12.54 39.89,12.75 39.89,14.21 v39.75,14.35 38.97,15.13 38.5,15.13 | D3.K 47.9,18.65 | 47.9,18.65 46.85,18.65 45.3,20.2 44.7,20.2 IC1.18 | 47.9,18.65 48.48,18.07 R2.2 47.67,16.87 47.46,16.66 v47.4,16.66 | ICSP1.2 89.23,13.53 88,12.3 85.7,12.3 85.31,12.7 60.41,12.7 57.6,15.5 52.4,15.5 51,14.1 50,14.1 49.4,14.7 v49.4,15 | v5.9,6.3 5.8,6.2 4.9,6.2 4.6,6.5 4.6,9.1 v2.5,11.2
  Bottom 0.152: v26.85,29.7 R4.1 | 19.8,14.8 19.8,18.75 23,21.95 23,24.35 23.3,24.65 23.3,28.4 22.9,28.8 v22.9,29.5 | 19.8,14.8 19.8,14.25 21.65,12.4 21.9,12.4 | R17.1 29,29.15 v29,27.95 | LED1.VCC 29.7,2.59 29.12,2 21.3,2 19.6,3.7 SPI-LED.5V | v47.4,16.66 47.4,16.4 48.3,15.5 48.9,15.5 v49.4,15 49.4,14.4 48.7,13.7 47.7,13.7 46.9,14.5 46.9,14.8 45.6,16.1 43.6,16.1 41.85,14.35 v39.75,14.35 | v20.77,38.33 20,37.55 20,34 19.5,33.5 18.5,33.5 13.8,38.2 7.2,38.2 6.6,37.59 U3.8 6.29,36.4 C11.2 4.2,34.9 1.2,31.9 1.2,12.5 v2.5,11.2 | I2C.5V 6.55,6.95 v5.9,6.3 | 19.8,14.8 20.75,15.75 C6.1 22.68,15.88 C3.P$2
  Bottom 0.61: I2C.5V 6.55,10.45 7.3,11.2 19.1,11.2 19.6,10.7
  Bottom 0.813: U$9.2 35.3,11.34 34.2,10.24 34.2,8.5 32.9,7.2 30.5,7.2 26.4,11.3 25.3,12.4 21.9,12.4 21.3,12.4 19.6,10.7 SPI-LED.5V
AVR_MISO  (via drill 0.35)
  Top 0.152: ICSP1.1 89.23,16.92 87.25,18.9 83,18.9 82.45,18.35 v82.5,18.3 | IC1.16 45.4,16.61 45.4,15.2 v45.7,14.9
  Bottom 0.152: v82.5,18.3 81.7,18.3 79.3,15.9 52.7,15.9 50,13.2 46.6,13.2 45.7,14.1 v45.7,14.9
AVR_MOSI  (via drill 0.35)
  Top 0.152: v41.15,16.55 42.2,17.6 43.27,17.6 IC1.15 44.6,16.27 44.6,14.8 45.4,14 45.9,14 47.8,15.9 50.9,15.9 51.3,16.3 58.2,16.3 61.1,13.4 85.6,13.4 86.1,12.9 87.7,12.9 88.1,13.3 88.1,14.81 ICSP1.4 | v32.6,12.5 30,12.5 27.85,10.35 27.85,7.45 v27.9,7.4
  Bottom 0.152: v41.15,16.55 40.05,15.45 33.65,15.45 33,14.8 33,12.9 v32.6,12.5 | LED1.SDI 28.1,7.4 v27.9,7.4
AVR_RESET  (via drill 0.35)
  Top 0.152: IC1.29 37.5,19.98 v37.5,19.9 | ICSP1.5 86.69,17.41 86.2,17.9 84.7,17.9 81.7,14.9 71.7,14.9 68.9,17.7 51.35,17.7 50.42,18.62 | 50.42,18.62 D3.A 49.65,19.4 47.15,19.4 v45.45,21.1 | R2.1 50.08,18.27 50.42,18.62
  Bottom 0.152: v37.5,19.9 37.8,19.6 C10.P$2 39.19,19.64 41.5,21.95 44.6,21.95 v45.45,21.1
AVR_RX
  Top 0.152: IC1.30 35.7,20.65 33.85,20.65 32.27,19.07 TP1.1
AVR_SCK  (via drill 0.35)
  Top 0.152: v39.45,17.1 39.45,17.15 41.65,19.35 42.35,19.35 43.1,18.6 44.23,18.6 IC1.17 44.74,18.51 v45.15,18.1 | v79,17.35 82.9,17.35 83.95,18.4 86.8,18.4 87.96,17.24 ICSP1.3 | v26.4,9.6 26.4,10.05 27.9,11.55 v27.9,11.6
  Bottom 0.152: v39.45,17.1 39.4,17.1 39.15,16.85 35.74,16.85 34.89,16 33.2,16 32.4,15.2 32.4,14.2 31.9,13.7 31.9,13 31.1,12.2 28.5,12.2 v27.9,11.6 27.94,11.56 | v45.15,18.1 47.7,18.1 48.45,17.35 v79,17.35 | LED1.CKI 28.9,7.5 27.7,8.7 26.7,8.7 26.4,9 v26.4,9.6
AVR_TX
  Top 0.152: IC1.31 35.02,20.2 34.45,20.2 33.5,19.25 33.5,19.2 33.55,19.15 33.55,18.5 32.03,16.98 TP2.1
BEC_50
  Bottom 0.152: U2.8 34.2,50.25 | 34.2,50.25 34.2,57.9 30.8,61.3 23.9,61.3 22.32,59.72 C15.2 21.93,58.43 IC5.5 | C5.P$2 34.2,50.25
BEC_60  (via drill 0.35)
  Top 0.152: IC3.16 17.5,36.79 C20.P$2 17.95,36.74 17.95,36.15 18.8,35.3 v18.8,34.65 | v25.4,52.65 24.25,51.5 v24.25,50.4 | U7.4 21.3,44.45 v21.3,45.4
  Bottom 0.152: D2.C 27.52,57.32 C21.2 26.12,57.37 IC5.1 24.5,57.35 23.55,57.35 23.1,56.9 23.1,55.85 23.48,55.47 IC5.3 25.65,54.34 25.65,52.8 25.5,52.65 v25.4,52.65 | 22.55,44.15 22.5,44.15 | 22.55,44.15 18.8,40.4 v18.8,34.65 | 22.55,44.15 22.55,45.06 C7.P$2 23.29,45.9 | v24.25,50.4 23.29,49.44 23.29,45.9 | v21.3,45.4 21.8,45.9 23.29,45.9
BEC_62  (via drill 0.35)
  Top 0.152: U$1.2:VCC3 5.22,47.27 R16.2 | U$1.16:TH_VCC 40.8,49.78 40.8,49.3 40.2,48.7 RCPWR.ANODE | v17.15,47 17.4,47.25 18.05,47.25 19.3,48.5 v19.3,49.35 | 20.36,49.7 U$1.8:VCC1 20.51,49.75 20.51,46.41 20.14,46.03 U1.1 | 20.25,49.8 20.36,49.7 | 20.6,49.45 20.36,49.7 | v40.78,53.27 v40.77,53.27 40.67,53.27 40.6,53.2 | 19.4,49.45 v19.3,49.35 | v19.3,49.35 19.64,49.7 20.36,49.7 | v28.3,53.1 30.62,50.78 U$1.12:ST_VCC
  Top 0.61: U$1.2:VCC3 5.22,51.08 3.2,53.1 3.2,59.1 5.5,61.4 36.6,61.4 40.78,57.22 v40.78,54.2 v40.78,53.27
  Top 0.813: 30.62,53.02 30.62,53.18 27.3,56.5 21.8,56.5 | 21.8,56.5 14.5,56.5 12.84,54.84 U$1.5:VCC2 | U$1.8:VCC1 20.46,55.16 21.8,56.5
  Top 1.27: U$1.12:ST_VCC 30.62,53.02 32.3,54.7 39.1,54.7 40.6,53.2 | U$1.16:TH_VCC v40.78,53.27
  Bottom 0.152: R15.2 16.67,46.52 v17.15,47 | U$3.2:VCC3 41.35,53.63 v40.78,54.2 | D2.A 27.68,53.73 v28.3,53.1
  pour Top (no thermals): 29.4,48.1 29.4,51.4 28.4,52.4 27.9,52.4 27.8,52.5 27.8,55.5 27.2,56.1 27.2,56.6 27.8,57.2 30.2,57.2 31.8,55.6 36.3,55.6 39.1,58.4 40,58.4 41.8,56.6 41.8,48.7 40.7,47.6 40.7,47.2 40.6,47.1 40.6,46.7 40.5,46.6 40,46.6 39.9,46.7 39.9,47.4 39.8,47.5 39.8,51.3 38,53.1 36.6,53.1 36,53.7 32.2,53.7 31.4,52.9 31.4,48.3 30.9,47.8 29.7,47.8
D3  (via drill 0.35)
  Top 0.152: IC1.1 34.18,17.27 33.81,16.9 33.1,16.9 30.65,14.45 30.65,13.95 31.1,13.5 32.9,13.5 33.4,13 33.4,11.5 33.9,11 33.9,8.6 35.4,7.1 38.3,7.1 40.8,4.6 v45.1,4.6 | v49.45,1.3 50.65,1.3 51.3,0.65 57.95,0.65 59.9,2.6 59.9,4.9 60.5,5.5 RC.ANODE
  Bottom 0.152: v45.1,4.6 48.4,1.3 v49.45,1.3
D4  (via drill 0.35)
  Top 0.152: IC1.2 37,18.15 38.1,18.15 v38.6,18.65 | v47.85,14.65 47.85,6.75 49.1,5.5 JETSON.ANODE
  Bottom 0.152: v38.6,18.65 39.9,18.65 41.3,17.25 45.35,17.25 47.85,14.75 v47.85,14.65
GND  (via drill 0.35)
  Top 0.152: 35.44,15.46 IC1.3 37.52,17.55 38.65,17.55 39.5,18.4 39.5,18.7 39.9,19.1 39.95,19.1 v41.3,20.45 41.56,20.45 IC1.21 43.14,22.03 C1.1 | R6.2 20.45,35.4 21.3,34.55 21.7,34.55 v21.8,34.65 | v24.15,36.85 23.47,37.53 U7.2 | v17.6,3.75 18.6,3.75 SW2.4 SW2.3 | SW1.3 38.05,44 | 38.05,44 SW1.6 | 26.9,36.55 v26.35,36.55 | v14.7,9.85 14.7,11.55 v15.8,12.65 | 8.8,26.2 8.8,28.9 10.35,30.45 20.1,30.45 | v10.1,25.6 9.4,25.6 8.8,26.2 | 20.15,30.45 20.1,30.45 | v26.35,36.55 26.45,36.65 C4.1 28.25,38.25 31.45,41.45 v31.55,41.45 34.05,43.95 v35.15,43.95 35.2,44 38.05,44 | v5.65,37.85 9.4,37.85 v12.15,35.1 | v4.35,32.8 7.05,30.1 | 8.8,26.2 8.35,26.2 7.05,27.5 7.05,30.1 | v26.35,36.55 26.75,36.15 v26.75,34.95 | v28.55,18 28.8,18.25 v28.8,21.75 27.4,23.15 26.95,23.15 | v25.85,21.95 22.25,21.95 19.32,19.02 v16.68,19.02 | U$9.30 70.62,10.1 68.08,10.1 U$9.25 66.78,8.65 65.33,10.1 60.4,10.1 U$9.20 | 35.44,15.46 36.4,14.5 36.74,14.5 IC1.5 | 35.44,15.46 34.89,16.01 33.11,16.01 31.6,14.5 v31.6,14.4 | ICSP1.6 87,14.64 v87,13.9 | 33.3,5.7 v35.3,5.7 | v36.8,2.7 37.1,2.4 46.2,2.4 46.96,3.16 46.96,8.3 U$9.9 | U$9.14 52.8,10.08 52.8,7.1 52.4,6.7 v51.3,6.7 v49.3,6.7 | v30.55,15.45 30.55,15.25 v28.5,13.2 27.9,12.6 25.8,12.6 22.8,9.6 22.8,8.4 24.6,6.6 32.5,6.6 33.4,5.7 v35.3,5.7 | v20.5,24.9 22.25,26.65 v22.25,28.35 25.85,28.35 26.85,27.35 v26.85,27.25 26.85,23.15 26.95,23.15 | 26.95,23.15 v26.9,23.1 | v35.3,5.7 37.7,5.7 v38,5.4 | 7.05,30.1 8,29.15 v8,29 | v21.25,29.75 20.8,29.75 20.1,30.45 | v6.8,14.2 v6.8,20.7 | v4.35,32.8 5.3,33.75 v5.3,34 6.2,33.1 v7,33.1 7.7,33.1 v8.7,34.1 | v83,4 84.56,5.56 U$9.39 86.96,6.4 90.3,6.4 92.3,8.4 92.3,16.2 89.1,19.4 80.7,19.4 v80.3,19 76.5,19 v76,19.5
  Top 0.152: v81,2 v79,4 | v77,2 v75,4 | v73,2 v71,4 | v69,2 v67,4 | v70.5,19.5 v64.5,19.5 | v58,19.5 v52,19.5 | v46,1.5 47.9,1.5 v49,2.6 49.5,3.1 49.72,3.1 R10.1 50.62,3.28 51.4,2.5 54.5,2.5 55.7,3.7 55.7,3.8 | 61.02,2.08 R5.1 | 61.02,2.08 61.7,1.4 64.4,1.4 v65,2 65,2.3 64.1,3.2 64.1,5.5 63.2,6.4 59.4,6.4 59,6 59,3.4 58.2,2.6 56.9,2.6 55.7,3.8 | v64.4,14.3 65.09,14.3 TP3.1 | R40.1 55.7,3.8 | X2.2 34.2,13.58 v34.2,11.8 | R40.1 55.8,3.9 v55.8,1.8 | R40.1 54.9,4 54.1,4.8 v54.1,5.9 | v60.3,1.3 61.02,2.02 61.02,2.08 | v5.6,4.2 v4.3,2.9 | v4.35,32.8 2.1,32.8 v1.3,33.6 | v2.7,34.8 1.7,35.8 v1.35,35.8 | v18.9,12.3 19.5,12.3 v21.3,14.1 21.6,13.8 v24.6,13.8 | v20.6,16.6 19.4,16.6 18.9,16.1 v18.9,14.6
  Bottom 0.152: C13.1 17.25,14.55 C16.1 16.9,16.45 R13.2 16.9,18.8 v16.68,19.02 16.15,19.55 15,19.55 | C17.1 18.8,25.15 C18.1 | C12.1 18.75,28.1 20.3,26.55 R36.1 19.25,25.4 C18.1 | 15,19.55 14.75,19.55 | 14.75,19.55 U4.10 | 14.75,19.55 14.25,19.05 U4.9 11.8,19.05 11.65,18.9 11.65,18.25 | U4.8 14.75,18.55 15,18.8 15,19.55 | U4.7 11.85,18.05 11.65,18.25 | U4.6 11.75,17.55 11.72,17.57 | 11.72,17.57 11.65,17.65 11.65,18.25 | U4.2 11.75,15.55 11.5,15.8 11.5,17.3 | 11.5,17.3 11.5,17.35 11.72,17.57 | 35,17.1 IC4.14 34.55,16.6 32.8,16.6 31.6,15.4 v31.6,14.4 v30.55,15.45 | v21.8,34.65 24,36.85 v24.15,36.85 24.45,36.55 v26.35,36.55 | 17.3,9.25 SPI-LED.GND | v17.6,3.75 SPI-LED.GND | 17.6,14.2 C13.1 | SPI-LED.GND 17.35,9.2 15.35,9.2 v14.7,9.85 | v15.8,12.65 17.3,14.15 C13.1 | U4.21 11.6,25.05 11.4,25.25 11.4,25.55 | 11.4,25.55 11.4,25.65 11.65,25.9 11.65,25.95 11.75,26.05 U4.23 | 22.25,28.3 v22.25,28.35 22.25,28.75 v21.25,29.75 21.45,29.75 26.65,34.95 v26.75,34.95 | v10.1,25.6 10.2,25.6 | 10.2,25.6 11.35,25.6 11.4,25.55 | IC4.1 29.08,23.1 | 29.08,23.1 29.08,23.37 U$10.1 | U$10.4 26.85,26.4 v26.85,27.25 | v5.65,37.85 4.45,37.85 C11.1 3.05,38.1 v2.35,38.8 v1.35,37.8 v2.35,36.8 v1.35,35.8 | v12.15,35.1 11.4,35.1 U3.5 | IC4.2 29.54,22.49 v28.8,21.75 | C9.P$2 22.26,17.09 U$11.#2 23.15,17.9 23.15,19.05 23.67,19.57 R1.1 | C2.1 25.09,22.71 v25.85,21.95 25.85,22.05 v26.9,23.1 | C6.2 22.75,14.25 | C9.P$2 21.1,16.89 | 25.82,14.12 26.45,13.5 27.29,13.5 R3.1 28.3,13.2 v28.5,13.2 | 25.82,14.12 25,14.95 25,15.04 | 25,15.04 C8.P$2 25.34,15.09 25.85,15.6 25.85,16.17 IC4.24 27.43,17.75 28.3,17.75 v28.55,18 28.55,17.45 v30.55,15.45
  Bottom 0.152: C10.P$1 40.96,20.45 v41.3,20.45 | v87,13.9 87,11.8 86.5,11.3 86.5,9.3 86,8.8 U$9.39 83.16,10.2 78.08,10.2 77.04,11.24 | 77.04,11.24 U$9.34 81.4,15.8 v81.5,15.8 | 77.04,11.24 77.04,11.14 76,10.1 73.1,10.1 U$9.30 71.86,13.14 70.7,14.3 v64.4,14.3 | U$9.9 46.46,7.04 47.7,5.8 48.4,5.8 v49.3,6.7 | v30.55,15.45 30.6,15.5 | C18.1 20,25.4 v20.5,24.9 | I2C.GND 4.55,10.55 6.5,12.5 6.8,12.5 7.9,13.6 | IC4.5 30.48,20.8 29.75,20.8 29.62,20.93 | 29.62,20.93 29.02,21.52 | 29.02,21.52 v28.8,21.75 | IC4.3 29.37,21.52 29.02,21.52 | IC4.4 29.69,20.93 29.62,20.93 | v28.8,21.75 28.8,22.82 29.08,23.1 | U4.14 11.85,21.55 | 11.85,21.55 11.8,21.6 11.8,21.9 11.95,22.05 U4.15 | 11.85,21.55 11.5,21.2 10.4,21.2 | 10.4,21.2 9.7,21.9 9.7,24 | 9.7,24 9.7,25.1 10.1,25.5 | 10.1,25.5 10.2,25.6 | U4.19 11.55,24.05 10.1,25.5 | U4.18 10.15,23.55 9.7,24 | 11.5,17.3 9.4,17.3 | 7.9,13.6 7.9,15.8 9.4,17.3 | v38,5.4 38,3.9 v36.8,2.7 v34.7,2.7 | v15.8,12.65 18.55,12.65 v18.9,12.3 v18.9,14.6 | LED1.GND 30.2,5.7 v35.3,5.7 35,6 35,9.8 35.3,10.1 37,10.1 37.6,10.7 37.6,12.2 36.6,13.2 35.6,13.2 v34.2,11.8 | 9.4,17.3 9.4,15.7 v9.7,15.4 | v15.8,12.65 14.95,12.65 v13.9,13.7 | 7.9,13.6 7.3,14.2 v6.8,14.2 | 10.4,21.2 10.4,20.8 v9.9,20.3 | v83,4 v81,2 | v79,4 v77,2 | v75,4 v73,2 | v71,4 v69,2 | v67,4 v65,2 | v76,19.5 v70.5,19.5 | v64.5,19.5 v58,19.5 | v46,1.5 42,1.5 v41.5,1 | v51.3,6.7 49.5,4.9 49.5,3.1 49.1,2.7 | 49.1,2.7 v49,2.6 | v52.5,1.7 50.9,1.7 49.9,2.7 49.1,2.7 | I2C.GND 3.6,9.9 v1.4,9.9 | I2C.GND 4.55,5.25 v5.6,4.2 | v4.3,2.9 5.9,2.9 v6.4,2.4 | v1.3,33.6 2.5,34.8 v2.7,34.8 | C6.2 21.35,14.05 v21.3,14.1 | C9.P$2 20.81,16.6 v20.6,16.6 | C6.2 23.02,14.05 C3.P$1 24.92,14.96 25,15.04
  Bottom 0.152: 25.82,14.12 24.93,14.12 v24.6,13.8
  pour Bottom (rank 6): -11.4,90 100.8,90 100.8,-9.9 -11.4,-9.9
  pour Top (rank 6): -11.6,90.3 101.1,90.3 101.1,-10.5 -11.6,-10.5
LED0
  Bottom 0.152: U$10.5 27.67,26.17 27.67,25.75 31.65,21.78 31.65,21.05 IC4.6
LED0_5
  Bottom 0.152: R41.1 R7.2 25.1,25.9 24.8,26.2 24.8,31 30,36.2 32.5,36.2 32.94,36.63 U2.2
LED0_5V
  Bottom 0.152: R41.2 26.9,23.95 U$10.3
LED1
  Bottom 0.152: IC4.7 31.27,19.75 28.65,19.75 27.6,20.8 27.6,22 28,22.4 28,23.3 27.7,23.6 U$10.2
LED1_5
  Bottom 0.152: U2.3 31.66,38.97 31.9,39.2 34.8,39.2 35.3,38.7 35.3,36.85 33.75,35.3 31.05,35.3 27,31.25 R43.2 27,30.7 27.9,29.8 R42.1
LED1_5V
  Bottom 0.152: U$10.6 28.35,27.5 R42.2
MODESWITCH  (via drill 0.35)
  Top 0.152: IC1.9 40.77,13.31 40.5,13.58 40.5,15.7 40.2,16 40.2,16.75 41.55,18.1 v41.55,18.2 | 40.55,38.5 SW1.2 40.55,40.3 | 40.55,40.3 SW1.5 | 40.55,40.3 41.45,41.2 v43.1,41.2
  Bottom 0.152: v41.55,18.2 44.1,18.2 46.55,20.65 46.55,21.25 45,22.8 45,39.1 45.4,39.5 45.4,40.2 44.4,41.2 v43.1,41.2
N$2
  Bottom 0.152: R7.1 25.75,27.1 R4.2 25.75,31.05 30.45,35.75 32.95,35.75 34.2,37.01 U2.1
N$3
  Bottom 0.152: U4.29 14.05,29.05 14.55,29.55 14.55,30.8 15.2,31.45 C22.2
N$4
  Top 0.152: IC1.20 44.3,22.06 C1.2
N$5
  Top 0.152: IC1.8 38.44,12.8 35.5,12.8 X2.3
N$6  (via drill 0.35)
  Top 0.152: v10.8,38.8 10.75,38.75 5.7,38.75 R26.1 | v18.25,45.6 18.8,45.6 19.1,45.3 19.1,44.23 U1.2
  Bottom 0.152: v18.25,45.6 16.45,45.6 14.7,43.85 14.7,41.25 12.4,38.95 10.95,38.95 v10.8,38.8
N$7
  Bottom 0.152: R3.2 26.51,15.91 IC4.23
N$8  (via drill 0.35)
  Top 0.152: IC1.13 43.18,15.57 43.7,15.05 v43.7,14.45 | v51.5,13.5 52.85,14.85 55.45,14.85 57.9,12.4 57.9,8 55.7,5.8 DONKEY.ANODE
  Bottom 0.152: v43.7,14.45 45.4,12.75 50.75,12.75 v51.5,13.5
N$9
  Bottom 0.152: R15.1 10.59,46.52 U3.4
N$10  (via drill 0.35)
  Top 0.152: IC3.3 15.75,42.25 16.3,41.7 24.7,41.7 v26.25,43.25
  Bottom 0.152: v26.25,43.25 26.95,43.95 32.15,43.95 32.95,44.75 32.95,48.23 U2.7
N$11  (via drill 0.35)
  Top 0.152: IC3.6 13.8,42.07 15.72,40.15 27.05,40.15 30.7,43.8 v30.7,45.3
  Bottom 0.152: U2.6 31.75,48.16 31.75,46.45 30.7,45.4 v30.7,45.3
N$12  (via drill 0.35)
  Top 0.152: R16.1 3.12,45.42 v3.15,45.4
  Bottom 0.152: v3.15,45.4 3.9,44.65 6,44.65 6.6,45.24 U3.1
N$13
  Bottom 0.152: 30.4,37.7 U2.4 30.4,39.3 31.1,40 35.1,40 36.1,39 36.1,36.8 34,34.7 31.5,34.7 28.95,32.15 28.95,30.4 | 28.95,30.4 R17.2 | R43.1 28.35,31 28.95,30.4
N$14
  Bottom 0.152: R13.1 14.7,17.05 U4.5
N$15
  Top 0.152: X2.1 34.22,15.3 34.9,15.3 36.9,13.3 37.8,13.3 IC1.7
N$16  (via drill 0.35)
  Top 0.152: v18.95,26.65 19.6,27.3 19.6,28 18.45,29.15 11.5,29.15 v10.8,28.45
  Bottom 0.152: C19.2 v18.95,26.65 | v10.8,28.45 11.2,28.05 U4.27
N$17
  Bottom 0.152: C13.2 15.35,14.5 14.4,15.45 14.4,15.85 14.2,16.05 U4.3
N$18
  Bottom 0.152: R31.2 15.15,22.15 14.25,23.05 U4.17
N$19
  Top 0.152: R5.2 62.62,5.46 RC.CATHODE
N$20
  Top 0.152: JETSON.CATHODE 52.22,5.47 R10.2
N$21
  Bottom 0.152: C19.1 15.25,26.65 14.35,27.55 U4.26
N$22
  Bottom 0.152: C22.1 16.3,30.3 15.75,30.3 15.4,29.95 15.4,29.6 14.35,28.55 U4.28
N$23
  Top 0.152: Q3.G 2.5,44.6 R24.1 1.65,44.65 R8.1
N$24
  Top 0.152: RCPWR.CATHODE 43.15,46.8 R9.1
N$25
  Bottom 0.152: U4.4 15.1,16.55 C16.2
N$26
  Top 0.152: R26.2 5.3,42.85 Q3.D
N$27
  Top 0.152: Q4.D 8.1,43.5 R27.2
N$28  (via drill 0.35)
  Top 0.152: R27.1 9.95,44.05 v9.95,44.8
  Bottom 0.152: v9.95,44.8 9.13,45.62 U3.3
N$29
  Top 0.152: Q5.D 8.1,45 6.45,46.65 R29.2
N$30  (via drill 0.35)
  Top 0.152: R29.1 6.05,44.9 6.85,44.1 7.45,44.1 v7.7,44.35
  Bottom 0.152: U3.2 7.7,46.53 v7.7,44.35
N$31
  Bottom 0.152: IC5.4 22.23,55.17 C14.2
N$32
  Bottom 0.152: C12.2 15.7,28.8 16.9,30 R25.2 17.6,30 18.6,29 19.7,29 D1.ANODE 21.45,27.25 21.45,23.05 21.35,22.95 21.35,22.65 20.45,21.75 17.75,21.75 R31.1
N$33
  Top 0.152: Q5.G 10.95,47.3 R32.1 11.5,46.75 R34.2
N$34  (via drill 0.35)
  Top 0.152: v28,3.6 28,2.8 27.3,2.1 25.1,2.1 24.2,3 v24.1,2.9
  Bottom 0.152: LED1.SDO 28.1,3.7 v28,3.6 | v24.1,2.9 23.6,3.4 SPI-LED.DI
N$35
  Top 0.152: U$1.15:TH_SINGNAL 38.27,49.77 38.27,48.23 39.08,47.42 R21.2
N$36
  Top 0.152: R20.2 28.02,49.74 U$1.11:ST_SIGNAL
N$37  (via drill 0.35)
  Top 0.152: v18.9,20.65 18.85,20.7 11.35,20.7 10.9,21.15 v10.9,22.2
  Bottom 0.152: R36.2 22.25,26.4 R37.1 22.25,22.95 19.95,20.65 v18.9,20.65 | U4.16 11.25,22.55 v10.9,22.2
N$38  (via drill 0.35)
  Top 0.152: v11.5,40.8 11.25,40.55 R33.1 10.1,39.9 9.65,39.45 7.1,39.45 6.75,39.8 Q4.G
  Bottom 0.152: R35.2 v11.5,40.8
N$39  (via drill 0.35)
  Top 0.152: v28.87,2.93 28.87,2.67 27.7,1.5 23.5,1.5 22.06,2.94 v22.04,2.94
  Bottom 0.152: LED1.CKO 28.9,2.97 v28.87,2.93 | v22.04,2.94 21.6,3.39 SPI-LED.CI
N$41  (via drill 0.35)
  Top 0.152: v25.2,17.1 23.45,17.1 v21.6,18.95
  Bottom 0.152: C9.P$1 21.54,18.25 22.1,18.25 | 22.1,18.25 U$11.#3 22.3,19.45 R1.2 21.8,18.95 v21.6,18.95 22.1,18.45 22.1,18.25 | IC4.25 25.86,17.1 v25.2,17.1
N$43
  Top 0.152: R30.1 21.38,37.16 U7.1
N$44
  Top 0.152: R40.2 DONKEY.CATHODE
N$50
  Bottom 0.152: U4.20 14.3,24.55 15.25,23.6 R19.2
PCH1  (via drill 0.35)
  Top 0.152: R12.1 22.85,46.85 21.7,48 v21.7,49.3 | U$1.7:SIGNAL1 17.92,52.02 v18.2,52.3
  Bottom 0.152: v18.2,52.3 18.8,52.9 20.3,52.9 21.7,51.5 v21.7,49.3
PCH2  (via drill 0.35)
  Top 0.152: U$1.4:SIGNAL2 10.3,55.1 9.05,56.35 v6.75,56.35
  Bottom 0.152: v6.75,56.35 5.8,55.4 R11.1
PCH3_328  (via drill 0.35)
  Top 0.152: U1.3 18.86,36.59 R6.1 19.45,36 19.45,35.1 21.75,32.8 27.25,32.8 35.05,40.6 v36,40.6 | IC1.26 38.87,22 v39.7,22
  Bottom 0.152: v39.7,22 39.7,22.05 44.3,26.65 44.3,36.9 40.6,40.6 v36,40.6
PCH6  (via drill 0.35)
  Top 0.152: IC3.1 17.05,45.45 18.9,47.3 v19.55,47.3 | U7.3 23.01,45.09 22.93,45.17 23.38,45.17 | 23.38,45.17 v21.4,47.15 | R28.1 23.98,45.17 23.38,45.17
  Bottom 0.152: v21.4,47.15 21.2,47.35 19.6,47.35 v19.55,47.3
PCH_1  (via drill 0.35)
  Top 0.152: R30.2 25.09,34.05 27,34.05 28,35.05 28,35.7 34.4,42.1 v36.4,42.1 | v39.1,20.55 39.1,20.35 37.5,18.75 35.34,18.75 IC1.32 | v44.3,40.1 45.3,39.1 45.3,25.35 v44.15,24.2
  Bottom 0.152: v39.1,20.55 39.3,20.55 41.95,23.2 43.15,23.2 v44.15,24.2 | v36.4,42.1 40.7,42.1 42.7,40.1 v44.3,40.1
PCH_3
  Top 0.152: R8.2 2.68,48.48 U$1.1:SIGNAL3
PH1-328  (via drill 0.35)
  Top 0.152: v16.9,33.8 18.9,33.8 20.4,32.3 28.1,32.3 32,36.2 42.95,36.2 44.7,34.45 44.7,26.35 41.84,23.5 41.84,23 IC1.23
  Bottom 0.152: U3.7 7.87,37.22 8.45,37.8 11.15,37.8 15.15,33.8 v16.9,33.8
PH2_328  (via drill 0.35)
  Top 0.152: v10.45,33.8 12.5,31.75 28.6,31.75 32.45,35.6 42.25,35.6 43.9,33.95 43.9,26.18 IC1.24
  Bottom 0.152: U3.6 9.13,35.12 v10.45,33.8
RCH1
  Top 0.152: R20.1 28.02,43.47 25.55,41 15.75,41 15.1,41.65 IC3.4
RCH2
  Top 0.152: IC3.7 13.15,41.7 15.4,39.45 27.95,39.45 35.27,46.77 R21.1
RECV_CH1  (via drill 0.35)
  Top 0.152: R34.1 15.9,46.75 16.4,46.25 IC3.2 16.4,42.7 16.7,42.4 23.8,42.4 v26.1,44.7 26.2,44.8 26.2,46.25 R12.2
RECV_CH2  (via drill 0.35)
  Top 0.152: IC3.5 14.45,44.75 v13.75,45.45
  Bottom 0.152: v13.75,45.45 13.1,44.8 R35.1 13.1,40.9 12.05,39.85 6.7,39.85 1.95,44.6 1.95,47.05 5.8,50.9 R11.2
SCL  (via drill 0.35)
  Top 0.152: v27.55,19.15 27.55,21.3 24.85,24 10.45,24 8.95,22.5 8.95,19.05 9.55,18.45 10.55,18.45 v10.75,18.25 10.75,15.65 13.1,13.3 13.1,10.9 v12.2,10 9.15,10 8.35,9.2 8.35,6.95 9.7,5.6 9.7,4.75 | IC1.28 37.24,21.46 36.95,21.75 32.9,21.75 30.15,19 30.15,16.7 28.6,15.15 20.6,15.15 15.75,10.3 17.5,8.55 17.5,6.05 14.9,3.45 11,3.45 9.7,4.75 | v9.95,2.7 9.7,2.95 9.7,4.75
  Bottom 0.152: I2C.SCL 11.6,10 v12.2,10 | v10.75,18.25 10.75,19.9 11.9,21.05 U4.13 | IC4.26 26.99,19.15 v27.55,19.15 | U$9.5 41.5,8.8 42.74,7.56 42.74,5.35 R22.1 37.99,0.6 12.05,0.6 v9.95,2.7
SDA  (via drill 0.35)
  Top 0.152: v10.35,6.55 11.2,7.4 11.2,8.5 11.8,9.1 13.3,9.1 13.81,9.61 13.81,12.21 15.9,14.3 15.9,17.2 16.7,18 v18.7,18 | v26.55,20.4 26.15,20.8 22.15,20.8 19.65,18.3 19,18.3 v18.7,18 | IC1.27 37.39,22.35 32.7,22.35 29.55,19.2 29.55,17.5 27.9,15.85 23.2,15.85 21.15,17.9 18.8,17.9 v18.7,18
  Bottom 0.152: I2C.SDA 8.55,7.5 9.5,6.55 v10.35,6.55 10.35,3.4 12.4,1.35 36.96,1.35 40.3,4.69 R23.1 40.3,6.86 38.84,8.31 U$9.3 | 15.35,20.6 17.5,20.6 18.9,19.2 18.9,18.2 v18.7,18 | 15.35,20.6 13.13,20.6 U4.12 | U4.11 14.8,20.05 15.35,20.6 | IC4.27 26.55,19.63 v26.55,20.4
SW
  Top 0.152: SW2.1 SW2.2 30.55,5.85 32.7,3.7 45.5,3.7 46,4.2 46,6.2 45.15,7.05 45.15,12.25 44.45,12.95 42.27,12.95 IC1.10

### Text on the board
tPlace: 3 | 2 | 1 | ST | TH | VCC | VCC | VCC | VCC | VCC | SIGNAL | SIGNAL | SIGNAL | SIGNAL | SIGNAL | D | J | ICSP | #612 | 1 | Rev 2.0.32
bPlace: Rev 2.0.32 | OUTLET | S/N | GND | BEC | F-612-2-32-A-N-J-0-JLC
Document: #612 JetRacer Rev 2.0.32 / 2023/11/07